# EAGLE design airball_display_board_v1 (EAGLE 9.1.1)
REV: 1

## Sheet 1 of 3
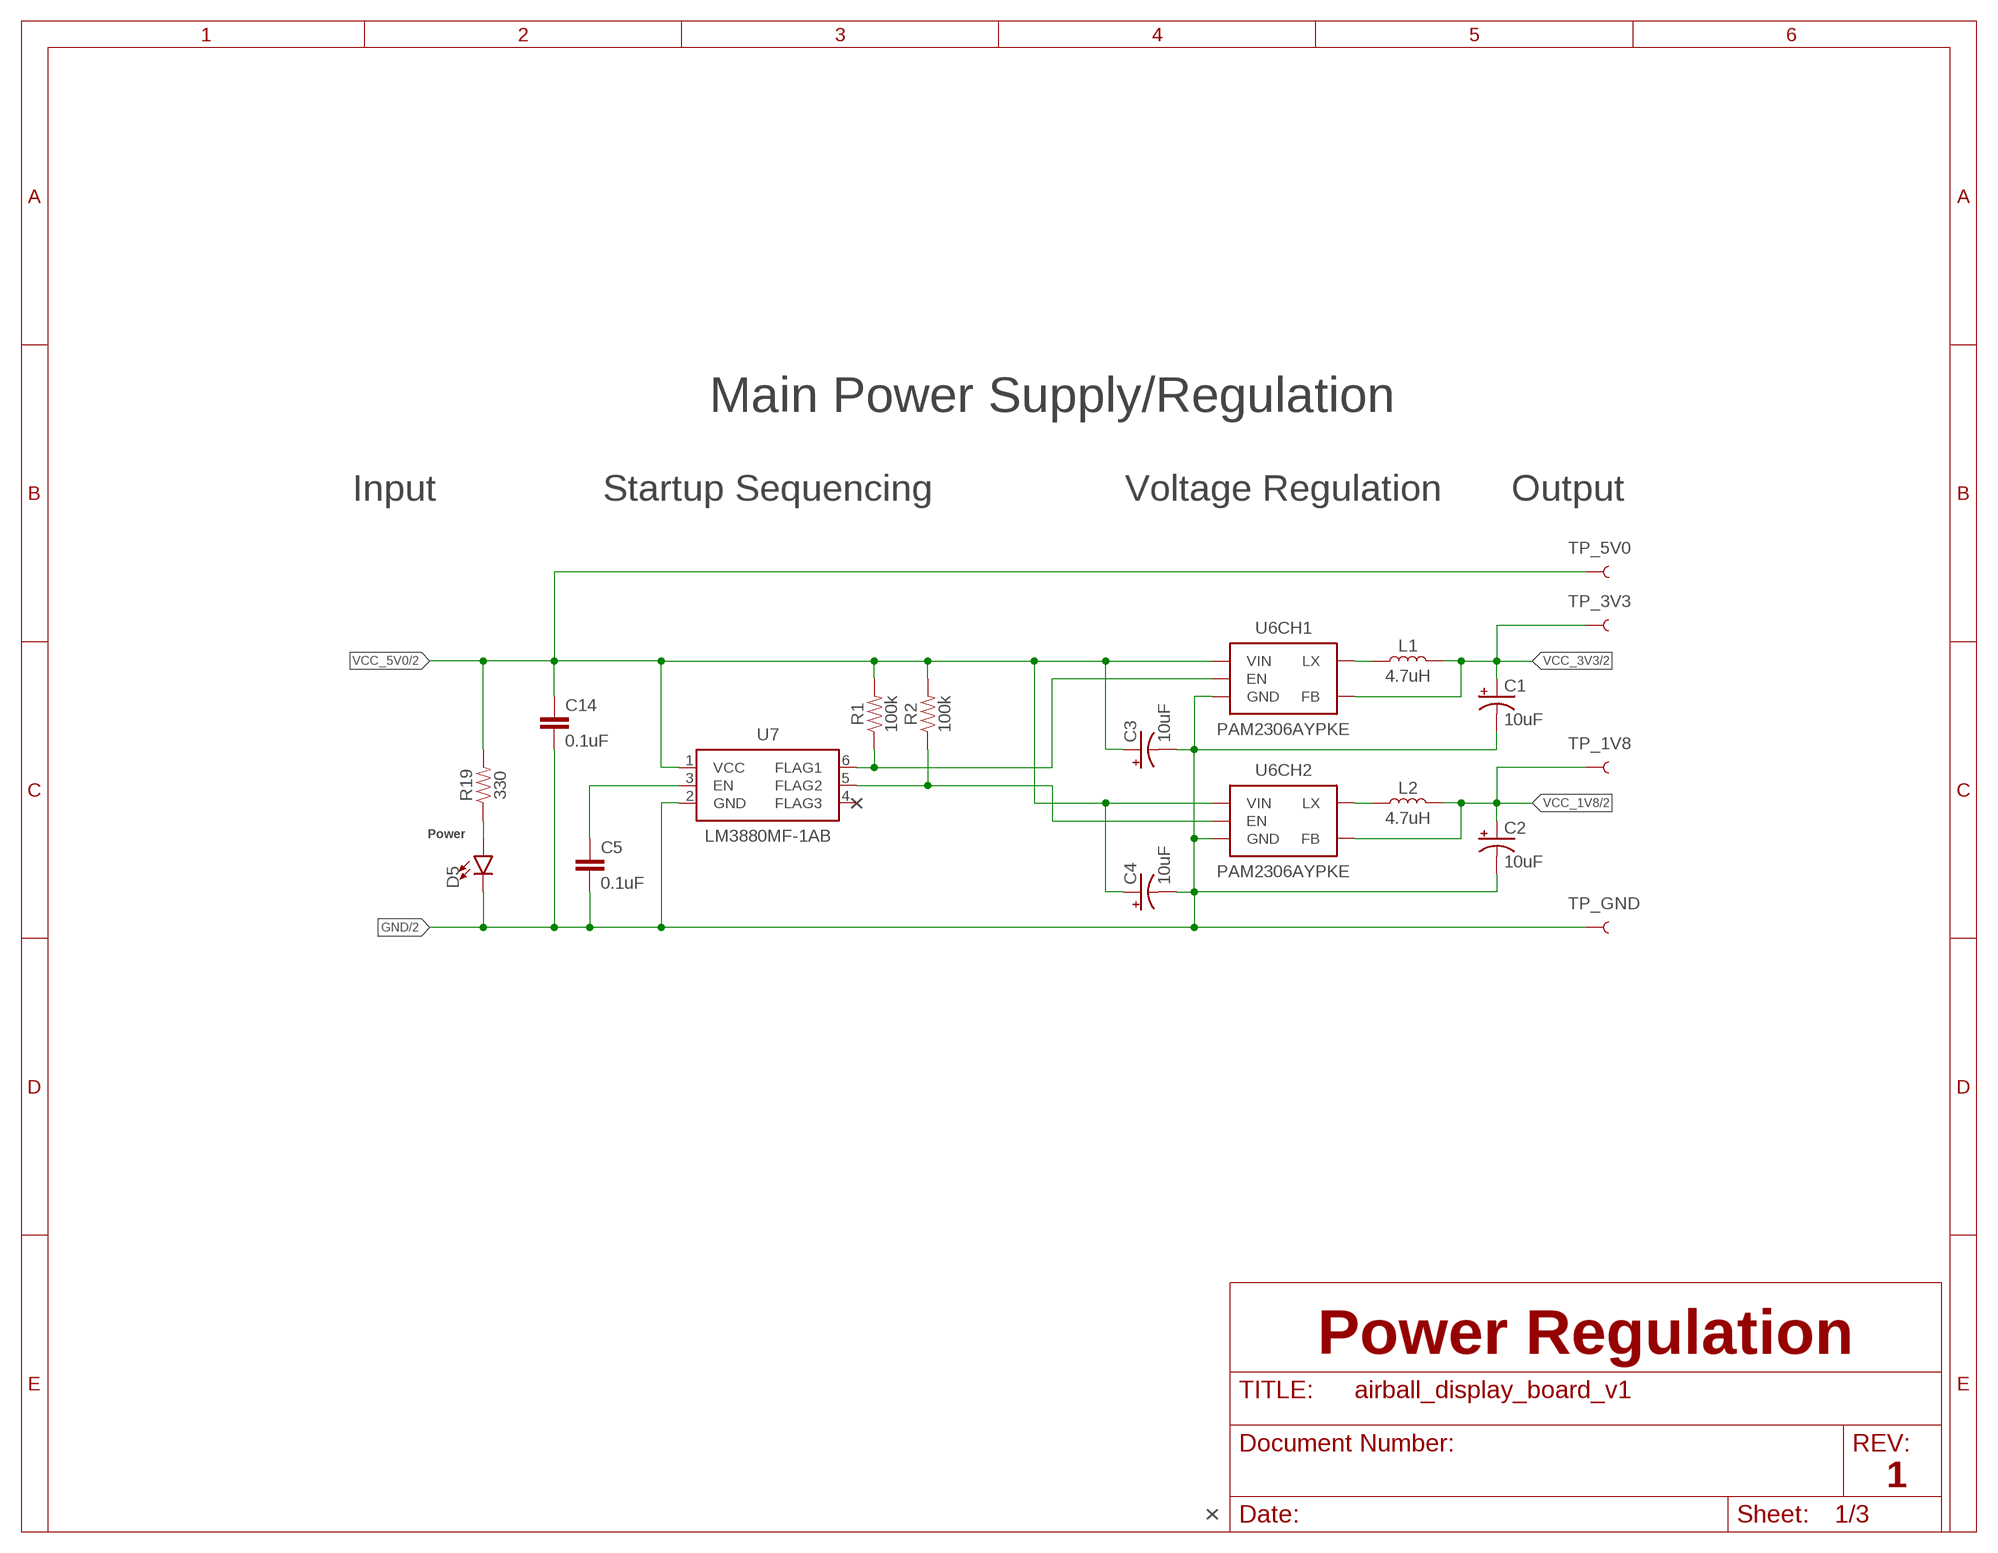
[diagram p0: schematic, sheet 1]

### Parts
C1  10uF  10UF-POLAR-EIA3216-16V-10%(TANT)  [EIA3216]
C2  10uF  10UF-POLAR-EIA3216-16V-10%(TANT)  [EIA3216]
C3  10uF  10UF-POLAR-EIA3216-16V-10%(TANT)  [EIA3216]
C4  10uF  10UF-POLAR-EIA3216-16V-10%(TANT)  [EIA3216]
C5  0.1uF  0.1UF-0603-25V-5%  [0603]
C14  0.1uF  0.1UF-0603-25V-5%  [0603]
D5  LED0603  [LED-0603]
L1  4.7uH  INDUCTOR-SMD_4X4  [INDUCTOR_SMD_4X4MM]
L2  4.7uH  INDUCTOR-SMD_4X4  [INDUCTOR_SMD_4X4MM]
R1  100k  100KOHM-0603-1/10W-1%  [0603]
R2  100k  100KOHM-0603-1/10W-1%  [0603]
R19  330  330OHM-0603-1/10W-1%  [0603]
TP_1V8  TEST-POINT3X5  [PAD.03X.05]
TP_3V3  TEST-POINT3X5  [PAD.03X.05]
TP_5V0  TEST-POINT3X5  [PAD.03X.05]
TP_GND  TEST-POINT3X5  [PAD.03X.05]
U6  PAM2306AYPKE  PAM2306  [WDFN12]
U7  LM3880MF-1AB  LM3880  [SOT23-6]

### Nets
EN_1V8: R2.1 U6.12(CH2:EN) U7.5(FLAG2)
EN_3V3: R1.1 U6.6(CH1:EN) U7.6(FLAG1)
GND [power]: C1.- C2.- C3.- C4.- C5.2 C14.2 D5.C TP_GND.P$1 U6.3(CH2:GND) U6.9(CH1:GND) U6.TH(CH1:GND) U7.2(GND) ; also sheet 2,3
L_VCC_1V8 [power]: L2.1 U6.2(CH2:LX)
L_VCC_3V3 [power]: L1.1 U6.8(CH1:LX)
N$17: C5.1 U7.3(EN)
R_POWER: D5.A R19.1
VCC_1V8 [power]: C2.+ L2.2 TP_1V8.P$1 U6.10(CH2:FB) ; also sheet 2
VCC_3V3 [power]: C1.+ L1.2 TP_3V3.P$1 U6.4(CH1:FB) ; also sheet 2,3
VCC_5V0 [power]: C3.+ C4.+ C14.1 R1.2 R2.2 R19.2 TP_5V0.P$1 U6.1(CH2:VIN) U6.7(CH1:VIN) U7.1(VCC) ; also sheet 2,3
Unconnected: U7.4(FLAG3)

### Notes on the sheet
- Main Power Supply/Regulation
- Input | Startup Sequencing | Voltage Regulation | Output
- ×
- Power
- Power Regulation
- ×

## Sheet 2 of 3
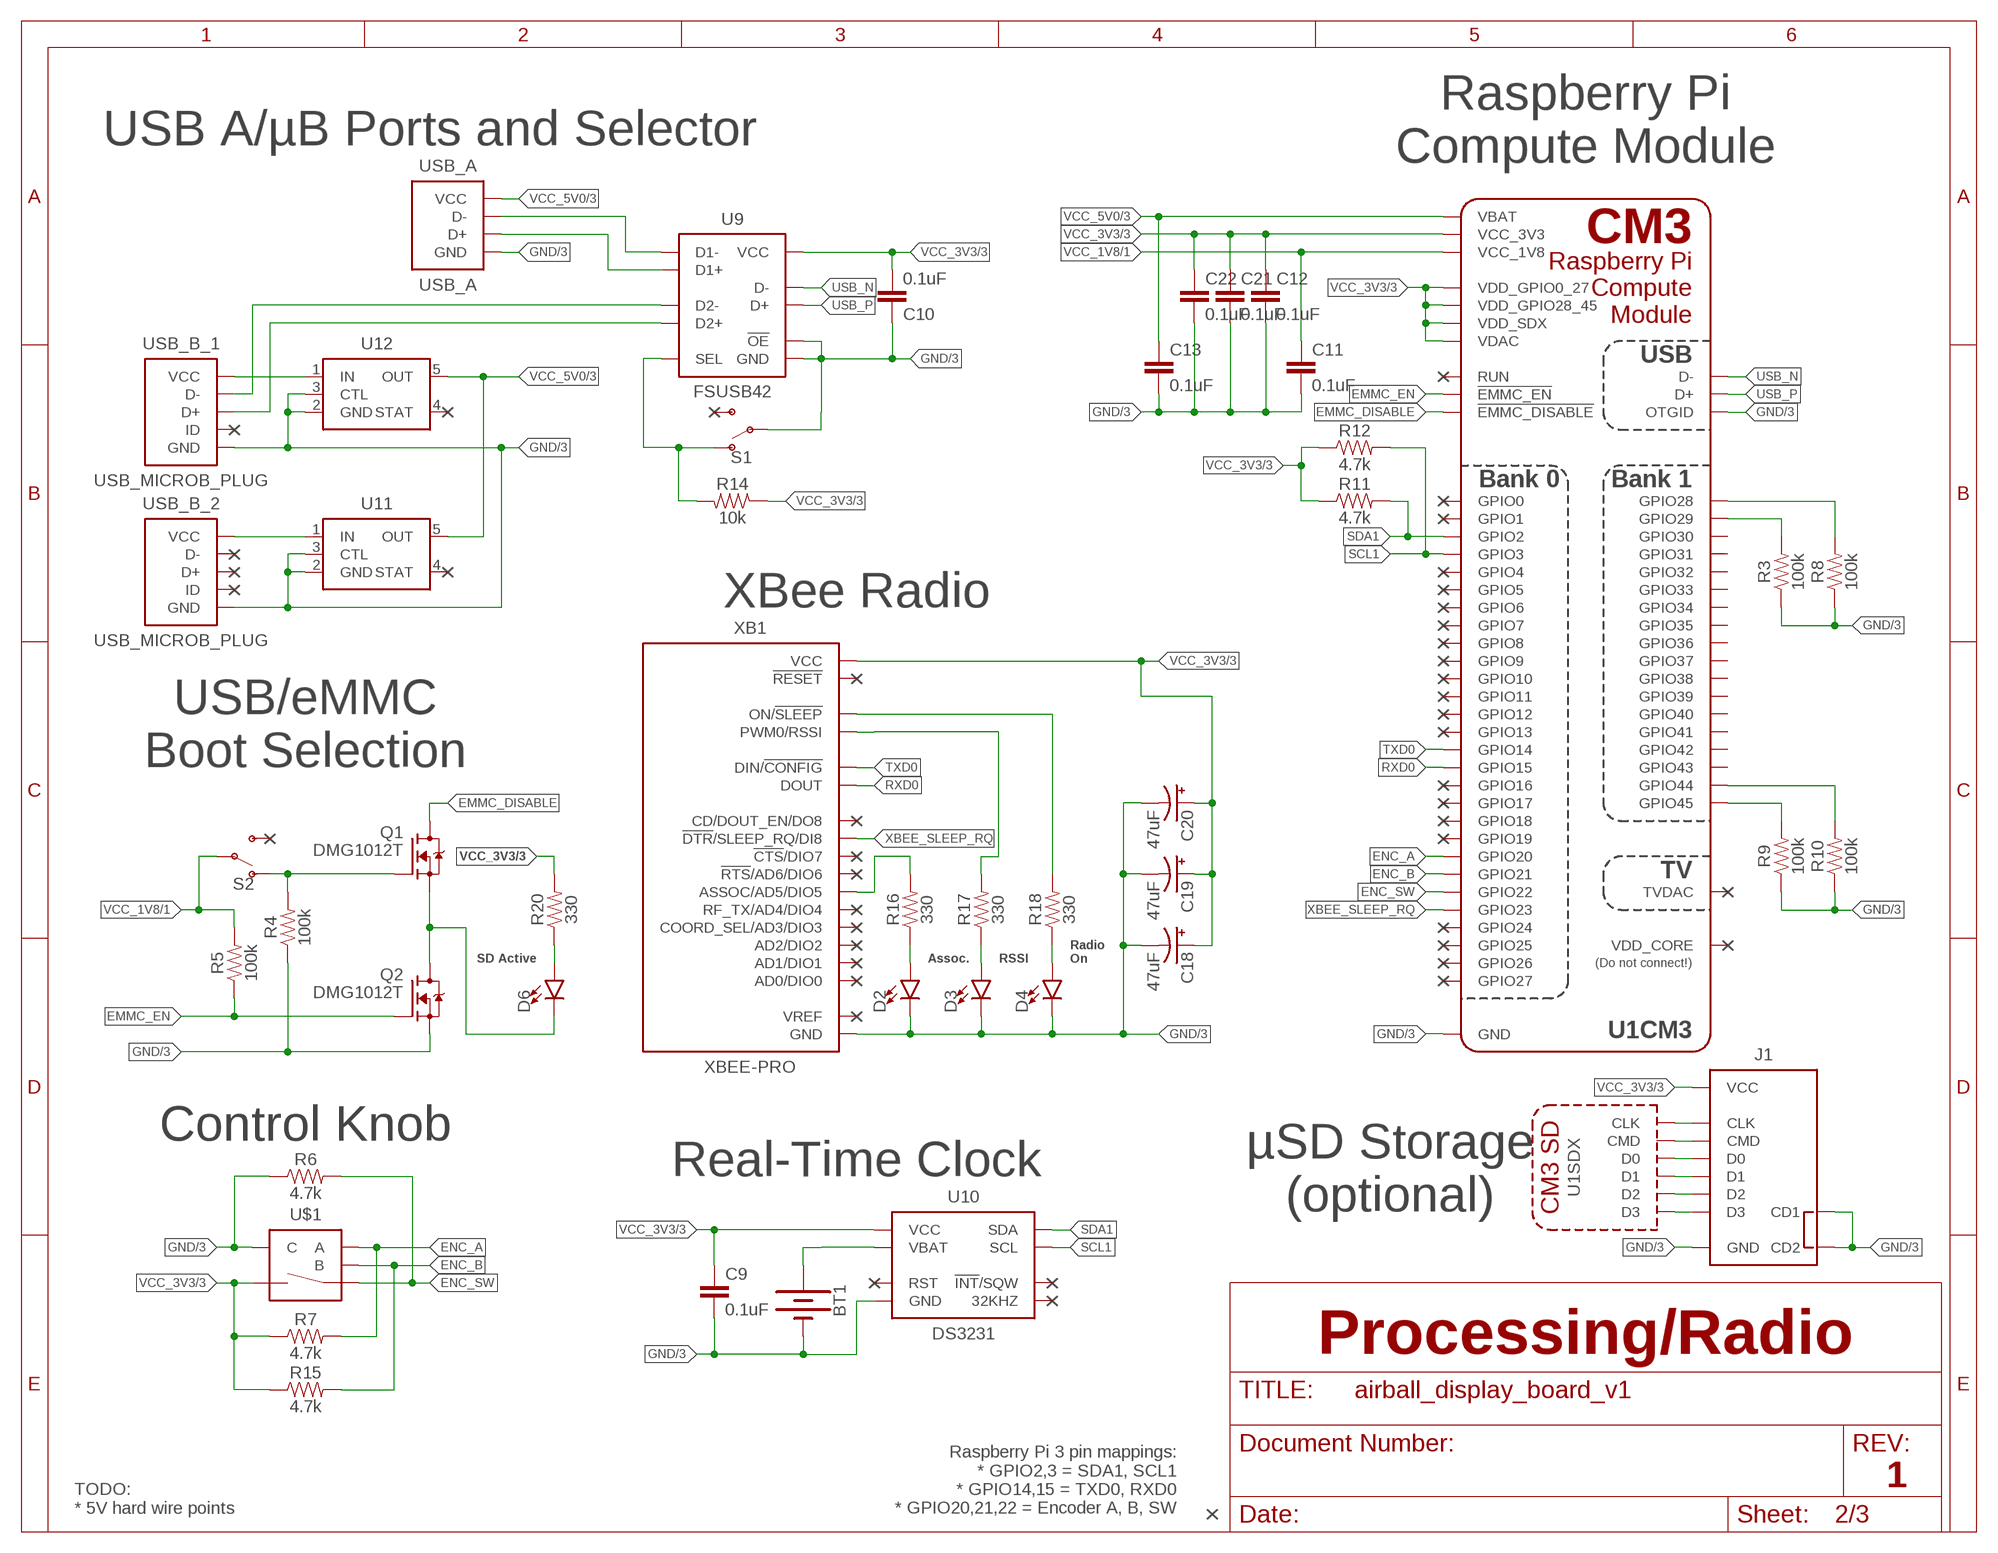
[diagram p1: schematic, sheet 2]

### Parts
BT1  BATTERY-12MM_SMD  [BATTCON_12MM]
C9  0.1uF  0.1UF-0603-25V-5%  [0603]
C10  0.1uF  0.1UF-0603-25V-5%  [0603]
C11  0.1uF  0.1UF-0603-25V-5%  [0603]
C12  0.1uF  0.1UF-0603-25V-5%  [0603]
C13  0.1uF  0.1UF-0603-25V-5%  [0603]
C18  47uF  47UF-POLAR-EIA3528-10V-10%  [EIA3528]
C19  47uF  47UF-POLAR-EIA3528-10V-10%  [EIA3528]
C20  47uF  47UF-POLAR-EIA3528-10V-10%  [EIA3528]
C21  0.1uF  0.1UF-0603-25V-5%  [0603]
C22  0.1uF  0.1UF-0603-25V-5%  [0603]
D2  LED0603  [LED-0603]
D3  LED0603  [LED-0603]
D4  LED0603  [LED-0603]
D6  LED0603  [LED-0603]
J1  MICRO-SD-SD4-MOLEX_104031  [MOLEX_MICRO_SD_104031]
Q1  DMG1012T  [SOT523-3]
Q2  DMG1012T  [SOT523-3]
R3  100k  100KOHM-0603-1/10W-1%  [0603]
R4  100k  100KOHM-0603-1/10W-1%  [0603]
R5  100k  100KOHM-0603-1/10W-1%  [0603]
R6  4.7k  4.7KOHM-0603-1/10W-1%  [0603]
R7  4.7k  4.7KOHM-0603-1/10W-1%  [0603]
R8  100k  100KOHM-0603-1/10W-1%  [0603]
R9  100k  100KOHM-0603-1/10W-1%  [0603]
R10  100k  100KOHM-0603-1/10W-1%  [0603]
R11  4.7k  4.7KOHM-0603-1/10W-1%  [0603]
R12  4.7k  4.7KOHM-0603-1/10W-1%  [0603]
R14  10k  10KOHM-0603-1/10W-1%  [0603]
R15  4.7k  4.7KOHM-0603-1/10W-1%  [0603]
R16  330  330OHM-0603-1/10W-1%  [0603]
R17  330  330OHM-0603-1/10W-1%  [0603]
R18  330  330OHM-0603-1/10W-1%  [0603]
R20  330  330OHM-0603-1/10W-1%  [0603]
S1  SWITCH-SPDT-SMD-RIGHT-ANGLE  [SWITCH_SPST_SMD_A]
S2  SWITCH-SPDT-SMD-RIGHT-ANGLE  [SWITCH_SPST_SMD_A]
U1  RPI_CM3-AMP_1473149  [AMP_1473149]
U9  FSUSB42  [MSOP10]
U10  DS3231  [SOIC16W]
U11  LTC4411  [SOT23-5]
U12  LTC4411  [SOT23-5]
U$1  ENCODER_WITH_SWITCH  [BOURNS_PEC11L]
USB_A  USB_A  [FCI_USB_A_87583]
USB_B_1  USB_MICROB_PLUG  [USB_MICRO_B_TYCO]
USB_B_2  USB_MICROB_PLUG  [USB_MICRO_B_TYCO]
XB1  XBEE-PRO  [XBEE-PRO]

### Nets
EMMC_DISABLE: Q1.2(D) U1.2(CM3:!EMMC_DISABLE)
EMMC_EN: Q2.1(G) R5.1 U1.90(CM3:!EMMC_EN)
ENC_A: R7.2 U1.69(CM3:GPIO20) U$1.A
ENC_B: R15.2 U1.71(CM3:GPIO21) U$1.B
ENC_SW: R6.2 U1.75(CM3:GPIO22) U$1.1(SW+)
GND [power]: BT1.GND(-) C9.2 C10.1 C11.2 C12.2 C13.2 C18.C(-) C19.C(-) C20.C(-) C21.2 C22.2 D2.C D3.C D4.C J1.6(GND) J1.CD1 J1.CD2 J1.SH@1(GND) J1.SH@2(GND) J1.SH@3(GND) J1.SH@4(GND) Q2.3(S) R3.1 R4.1 R6.1 R8.1 R9.1 R10.1 S1.2(P) U1.1(CM3:GND) U1.7(CM3:GND) U1.8(CM3:GND) U1.13(CM3:GND) U1.14(CM3:GND) U1.19(CM3:GND) U1.20(CM3:GND) U1.25(CM3:GND) U1.26(CM3:GND) U1.31(CM3:GND) U1.32(CM3:GND) U1.37(CM3:GND) U1.38(CM3:GND) U1.43(CM3:GND) U1.44(CM3:GND) U1.49(CM3:GND) U1.50(CM3:GND) U1.55(CM3:GND) U1.56(CM3:GND) U1.61(CM3:GND) U1.62(CM3:GND) U1.67(CM3:GND) U1.68(CM3:GND) U1.73(CM3:GND) U1.74(CM3:GND) U1.79(CM3:GND) U1.80(CM3:GND) U1.85(CM3:GND) U1.86(CM3:GND) U1.91(CM3:GND) U1.92(CM3:GND) U1.97(CM3:GND) U1.98(CM3:GND) U1.103(CM3:GND) U1.104(CM3:GND) U1.109(CM3:GND) U1.110(CM3:GND) U1.115(CM3:GND) U1.116(CM3:GND) U1.121(CM3:GND) U1.122(CM3:GND) U1.127(CM3:GND) U1.133(CM3:GND) U1.134(CM3:GND) U1.139(CM3:GND) U1.140(CM3:GND) U1.145(CM3:GND) U1.146(CM3:GND) U1.151(CM3:GND) U1.152(CM3:GND) U1.157(CM3:GND) U1.163(CM3:GND) U1.164(CM3:GND) U1.168(CM3:OTGID) U1.169(CM3:GND) U1.170(CM3:GND) U1.181(CM3:GND) U1.182(CM3:GND) U1.187(CM3:GND) U1.188(CM3:GND) U1.195(CM3:GND) U1.196(CM3:GND) U9.5(GND) U9.10(!OE) U10.5(GND) U10.6(GND) U10.7(GND) U10.8(GND) U10.9(GND) U10.10(GND) U10.11(GND) U10.12(GND) U10.13(GND) U11.2(GND) U11.3(CTL) U12.2(GND) U12.3(CTL) U$1.C USB_A.GND USB_A.SH@1(GND) USB_A.SH@2(GND) USB_B_1.5(GND) USB_B_1.SH@1(GND) USB_B_1.SH@2(GND) USB_B_1.SH@3(GND) USB_B_1.SH@4(GND) USB_B_2.5(GND) USB_B_2.SH@1(GND) USB_B_2.SH@2(GND) USB_B_2.SH@3(GND) USB_B_2.SH@4(GND) XB1.10(GND) ; also sheet 1,3
LED_ACT: D6.C Q1.3(S) Q2.2(D)
N$26 [power]: R14.2 S1.1(O) U9.2(SEL)
PD_GPIO28: R8.2 U1.28(CM3:GPIO28)
PD_GPIO29: R3.2 U1.30(CM3:GPIO29)
PD_GPIO44: R10.2 U1.82(CM3:GPIO44)
PD_GPIO45: R9.2 U1.84(CM3:GPIO45)
R_SD_ACT: D6.A R20.1
R_XBEE_ASSOC: D2.A R16.1
R_XBEE_ON: D4.A R18.1
R_XBEE_RSSI: D3.A R17.1
RTC_VBAT [power]: BT1.PWR@1(+) U10.14(VBAT)
RXD0: U1.53(CM3:GPIO15) XB1.2(DOUT)
SCL1: R12.2 U1.11(CM3:GPIO3) U10.16(SCL)
SD_CLK: J1.5(CLK) U1.10(SDX:CLK)
SD_CMD: J1.3(CMD) U1.12(SDX:CMD)
SD_D0: J1.7(D0) U1.16(SDX:D0)
SD_D1: J1.8(D1) U1.18(SDX:D1)
SD_D2: J1.1(D2) U1.22(SDX:D2)
SD_D3: J1.2(D3) U1.24(SDX:D3)
SDA1: R11.2 U1.9(CM3:GPIO2) U10.15(SDA)
TXD0: U1.51(CM3:GPIO14) XB1.3(DIN/!CONFIG)
USB_A_N: U9.6(D1-) USB_A.D-
USB_A_P: U9.7(D1+) USB_A.D+
USB_A_VCC [power]: U12.1(IN) USB_B_1.1(VCC)
USB_B_N: U9.8(D2-) USB_B_1.2(D-)
USB_B_P: U9.9(D2+) USB_B_1.3(D+)
USB_B_VCC [power]: U11.1(IN) USB_B_2.1(VCC)
USB_BOOT_EN: Q1.1(G) R4.2 S2.1(O)
USB_N: U1.167(CM3:D-) U9.4(D-)
USB_P: U1.165(CM3:D+) U9.3(D+)
VCC_1V8 [power]: C11.1 R5.2 S2.2(P) U1.183(CM3:VCC_1V8) U1.184(CM3:VCC_1V8) U1.185(CM3:VCC_1V8) U1.186(CM3:VCC_1V8) ; also sheet 1
VCC_3V3 [power]: C9.1 C10.2 C12.1 C18.A(+) C19.A(+) C20.A(+) C21.1 C22.1 J1.4(VCC) R7.1 R11.1 R12.1 R14.1 R15.1 R20.2 U1.4(CM3:VDD_SDX) U1.6(CM3:VDD_SDX) U1.39(CM3:VDD_GPIO0_27) U1.40(CM3:VDD_GPIO0_27) U1.41(CM3:VDD_GPIO28_45) U1.42(CM3:VDD_GPIO28_45) U1.189(CM3:VDAC) U1.190(CM3:VDAC) U1.191(CM3:VCC_3V3) U1.192(CM3:VCC_3V3) U1.193(CM3:VCC_3V3) U1.194(CM3:VCC_3V3) U9.1(VCC) U10.2(VCC) U$1.2(SW-) XB1.1(VCC) ; also sheet 1,3
VCC_5V0 [power]: C13.1 U1.197(CM3:VBAT) U1.198(CM3:VBAT) U1.199(CM3:VBAT) U1.200(CM3:VBAT) U11.5(OUT) U12.5(OUT) USB_A.VBUS(VCC) ; also sheet 1,3
XBEE_ASSOC: R16.2 XB1.15(ASSOC/AD5/DIO5)
XBEE_ON: R18.2 XB1.13(ON/!SLEEP)
XBEE_RSSI: R17.2 XB1.6(PWM0/RSSI)
XBEE_SLEEP_RQ: U1.77(CM3:GPIO23) XB1.9(!DTR!/SLEEP_RQ/DI8)
Unconnected: S1.3(S) S2.3(S) U1.3(CM3:GPIO0) U1.5(CM3:GPIO1) U1.15(CM3:GPIO4) U1.17(CM3:GPIO5) U1.21(CM3:GPIO6) U1.23(CM3:GPIO7) U1.27(CM3:GPIO8) U1.29(CM3:GPIO9) U1.33(CM3:GPIO10) U1.34(CM3:GPIO30) U1.35(CM3:GPIO11) U1.36(CM3:GPIO31) U1.45(CM3:GPIO12) U1.46(CM3:GPIO32) U1.47(CM3:GPIO13) U1.48(CM3:GPIO33) U1.52(CM3:GPIO34) U1.54(CM3:GPIO35) U1.57(CM3:GPIO16) U1.58(CM3:GPIO36) U1.59(CM3:GPIO17) U1.60(CM3:GPIO37) U1.63(CM3:GPIO18) U1.64(CM3:GPIO38) U1.65(CM3:GPIO19) U1.66(CM3:GPIO39) U1.70(CM3:GPIO40) U1.72(CM3:GPIO41) U1.76(CM3:GPIO42) U1.78(CM3:GPIO43) U1.81(CM3:GPIO24) U1.83(CM3:GPIO25) U1.87(CM3:GPIO26) U1.89(CM3:GPIO27) U1.93(DSI0:D1_N) U1.94(DSI1:D0_P) U1.95(DSI0:D1_P) U1.96(DSI1:D0_N) U1.99(DSI0:D0_N) U1.100(DSI1:C_P) U1.101(DSI0:D0_P) U1.102(DSI1:C_N) U1.105(DSI0:C_N) U1.106(DSI1:D3_P) U1.107(DSI0:C_P) U1.108(DSI1:D3_N) U1.112(DSI1:D2_P) U1.114(DSI1:D2_N) U1.118(DSI1:D1_P) U1.120(DSI1:D1_N) U1.135(CAM1:D3_P) U1.136(CAM0:D0_P) U1.137(CAM1:D3_N) U1.138(CAM0:D0_N) U1.141(CAM1:D2_P) U1.142(CAM0:C_P) U1.143(CAM1:D2_N) U1.144(CAM0:C_N) U1.147(CAM1:C_P) U1.148(CAM0:D1_P) U1.149(CAM1:C_N) U1.150(CAM0:D1_N) U1.153(CAM1:D1_P) U1.155(CAM1:D1_N) U1.159(CAM1:D0_P) U1.161(CAM1:D0_N) U1.166(CM3:TVDAC) U1.172(VCJTAG:!TRST) U1.174(VCJTAG:TDI) U1.176(VCJTAG:TMS) U1.177(CM3:RUN) U1.178(VCJTAG:TDO) U1.179(CM3:VDD_CORE) U1.180(VCJTAG:TCK) U10.1(32KHZ) U10.3(!INT!/SQW) U10.4(RST) U11.4(STAT) U12.4(STAT) USB_B_1.4(ID) USB_B_2.2(D-) USB_B_2.3(D+) USB_B_2.4(ID) XB1.4(CD/DOUT_EN/DO8) XB1.5(!RESET) XB1.11(RF_TX/AD4/DIO4) XB1.12(!CTS!/DIO7) XB1.14(VREF) XB1.16(!RTS!/AD6/DIO6) XB1.17(COORD_SEL/AD3/DIO3) XB1.18(AD2/DIO2) XB1.19(AD1/DIO1) XB1.20(AD0/DIO0)

### Notes on the sheet
- USB A/µB Ports and Selector
- Raspberry Pi
  Compute Module
- ×
- × | ×
- ×
- ×
- ×
- ×
- × | × | ×
- × | ×
- XBee Radio | ×
- ×
- ×
- ×
- × | ×
- ×
- ×
- ×
- USB/eMMC
  Boot Selection
- ×
- ×
- × | ×
- × | ×
- ×
- ×
- ×
- ×
- × | ×
- × | × | ×
- SD Active | × | Assoc. | RSSI
- Radio
  On
- ×
- × | ×
- ×
- Control Knob
- Real-Time Clock
- µSD Storage
  (optional)
- × | ×
- ×
- Processing/Radio
- TODO:
  * 5V hard wire points
- Raspberry Pi 3 pin mappings:
  * GPIO2,3 = SDA1, SCL1
  * GPIO14,15 = TXD0, RXD0
  * GPIO20,21,22 = Encoder A, B, SW
- ×

## Sheet 3 of 3
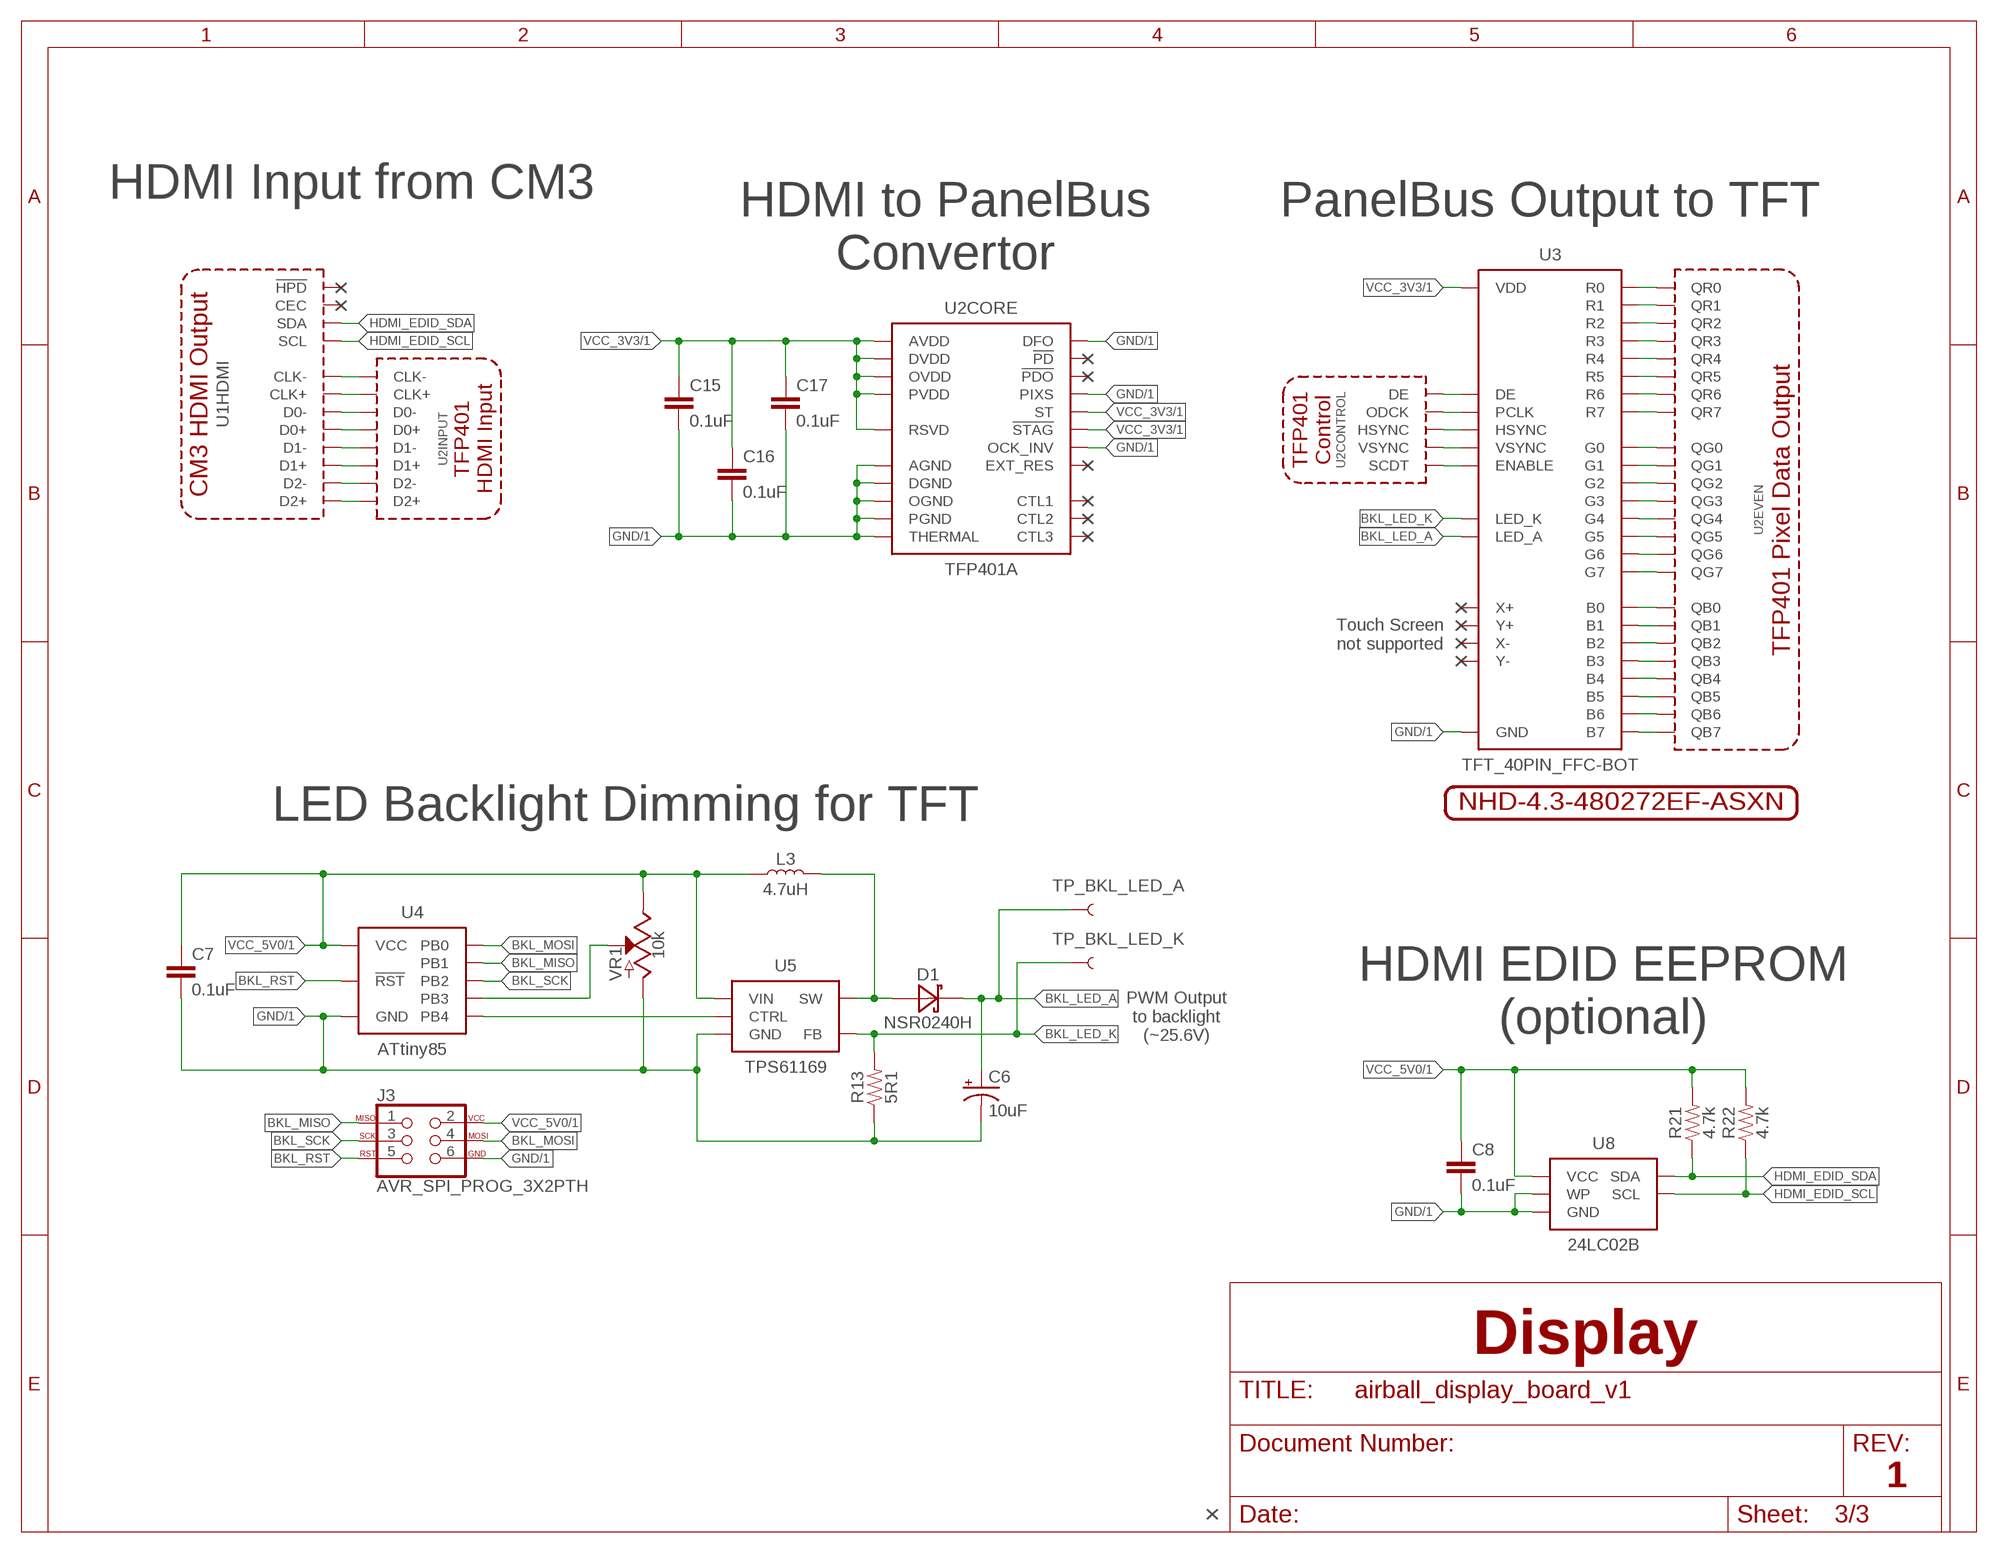
[diagram p2: schematic, sheet 3]

### Parts
C6  10uF  10UF-POLAR-EIA3216-16V-10%(TANT)  [EIA3216]
C7  0.1uF  0.1UF-0603-25V-5%  [0603]
C8  0.1uF  0.1UF-0603-25V-5%  [0603]
C15  0.1uF  0.1UF-0603-25V-5%  [0603]
C16  0.1uF  0.1UF-0603-25V-5%  [0603]
C17  0.1uF  0.1UF-0603-25V-5%  [0603]
D1  NSR0240H  DIODE-SCHOTTKY-SOD323  [SOD323]
J3  AVR_SPI_PROG_3X2PTH  [2X3]
L3  4.7uH  INDUCTOR-SMD_4X4  [INDUCTOR_SMD_4X4MM]
R13  5R1  RESISTOR0603  [0603]
R21  4.7k  4.7KOHM-0603-1/10W-1%  [0603]
R22  4.7k  4.7KOHM-0603-1/10W-1%  [0603]
TP_BKL_LED_A  TEST-POINT3X5  [PAD.03X.05]
TP_BKL_LED_K  TEST-POINT3X5  [PAD.03X.05]
U2  TFP401A  TFP401-POWER_LITE  [TQFP100_POWER_LITE]
U3  TFT_40PIN_FFC-BOT  [HIROSE_FFC40_FH12-40S-0.5SH]
U4  ATtiny85  ATTINY25/45/85  [SOIC8-5.4]
U5  TPS61169  [SOT353-5]
U8  24LC02B  [SOT23-5]
U$4  NHD-4.3-480272EF-ASXN  [NHD-4.3-480272EF-ASXN]
VR1  10k  POTENTIOMETERPTV09A  [BOURNS_PTV09A]

### Nets
B0: U2.10(EVEN:QB0) U3.21(B0)
B1: U2.11(EVEN:QB1) U3.22(B1)
B2: U2.12(EVEN:QB2) U3.23(B2)
B3: U2.13(EVEN:QB3) U3.24(B3)
B4: U2.14(EVEN:QB4) U3.25(B4)
B5: U2.15(EVEN:QB5) U3.26(B5)
B6: U2.16(EVEN:QB6) U3.27(B6)
B7: U2.17(EVEN:QB7) U3.28(B7)
BKL_ADJ: U4.2(PB3) VR1.2(S)
BKL_LED_A [power]: C6.+ D1.K(C) TP_BKL_LED_A.P$1 U3.2(LED_A)
BKL_LED_K [power]: R13.2 TP_BKL_LED_K.P$1 U3.1(LED_K) U5.3(FB)
BKL_MISO: J3.1 U4.6(PB1)
BKL_MOSI: J3.4 U4.5(PB0)
BKL_PWM: U4.3(PB4) U5.4(CTRL)
BKL_RST: J3.5 U4.1(!RST)
BKL_SCK: J3.3 U4.7(PB2)
DE: U2.46(CONTROL:DE) U3.34(DE)
G0: U2.20(EVEN:QG0) U3.13(G0)
G1: U2.21(EVEN:QG1) U3.14(G1)
G2: U2.22(EVEN:QG2) U3.15(G2)
G3: U2.23(EVEN:QG3) U3.16(G3)
G4: U2.24(EVEN:QG4) U3.17(G4)
G5: U2.25(EVEN:QG5) U3.18(G5)
G6: U2.26(EVEN:QG6) U3.19(G6)
G7: U2.27(EVEN:QG7) U3.20(G7)
GND [power]: C6.- C7.2 C8.2 C15.2 C16.2 C17.2 J3.6 R13.1 U2.1(CORE:DFO) U2.4(CORE:PIXS) U2.5(CORE:DGND) U2.19(CORE:OGND) U2.28(CORE:OGND) U2.39(CORE:DGND) U2.45(CORE:OGND) U2.58(CORE:OGND) U2.68(CORE:DGND) U2.76(CORE:OGND) U2.79(CORE:AGND) U2.83(CORE:AGND) U2.87(CORE:AGND) U2.89(CORE:AGND) U2.92(CORE:AGND) U2.98(CORE:PGND) U2.100(CORE:OCK_INV) U2.TH21(CORE:THERMAL) U2.TH22(CORE:THERMAL) U2.TH23(CORE:THERMAL) U2.TH24(CORE:THERMAL) U2.TH25(CORE:THERMAL) U2.TH30(CORE:THERMAL) U2.TH34(CORE:THERMAL) U2.TH39(CORE:THERMAL) U2.TH43(CORE:THERMAL) U2.TH48(CORE:THERMAL) U2.TH52(CORE:THERMAL) U2.TH57(CORE:THERMAL) U2.TH58(CORE:THERMAL) U2.TH59(CORE:THERMAL) U2.TH60(CORE:THERMAL) U2.TH61(CORE:THERMAL) U2.THA(CORE:THERMAL) U2.THB(CORE:THERMAL) U3.3(GND) U3.29(GND) U3.36(GND) U4.4(GND) U5.2(GND) U8.2(GND) U8.5(WP) VR1.1(A) ; also sheet 1,2
HDMI_CLK_N: U1.111(HDMI:CLK-) U2.94(INPUT:CLK-)
HDMI_CLK_P: U1.113(HDMI:CLK+) U2.93(INPUT:CLK+)
HDMI_D0_N: U1.117(HDMI:D0-) U2.91(INPUT:D0-)
HDMI_D0_P: U1.119(HDMI:D0+) U2.90(INPUT:D0+)
HDMI_D1_N: U1.123(HDMI:D1-) U2.86(INPUT:D1-)
HDMI_D1_P: U1.125(HDMI:D1+) U2.85(INPUT:D1+)
HDMI_D2_N: U1.129(HDMI:D2-) U2.81(INPUT:D2-)
HDMI_D2_P: U1.131(HDMI:D2+) U2.80(INPUT:D2+)
HDMI_EDID_SCL: R22.1 U1.175(HDMI:SCL) U8.1(SCL)
HDMI_EDID_SDA: R21.1 U1.173(HDMI:SDA) U8.3(SDA)
HSYNC: U2.48(CONTROL:HSYNC) U3.32(HSYNC)
L_BKL [power]: D1.A L3.2 U5.1(SW)
PCLK: U2.44(CONTROL:ODCK) U3.30(PCLK)
R0: U2.30(EVEN:QR0) U3.5(R0)
R1: U2.31(EVEN:QR1) U3.6(R1)
R2: U2.32(EVEN:QR2) U3.7(R2)
R3: U2.33(EVEN:QR3) U3.8(R3)
R4: U2.34(EVEN:QR4) U3.9(R4)
R5: U2.35(EVEN:QR5) U3.10(R5)
R6: U2.36(EVEN:QR6) U3.11(R6)
R7: U2.37(EVEN:QR7) U3.12(R7)
SCDT: U2.8(CONTROL:SCDT) U3.31(ENABLE)
VCC_3V3 [power]: C15.1 C16.1 C17.1 U2.3(CORE:ST) U2.6(CORE:DVDD) U2.7(CORE:!STAG) U2.18(CORE:OVDD) U2.29(CORE:OVDD) U2.38(CORE:DVDD) U2.43(CORE:OVDD) U2.57(CORE:OVDD) U2.67(CORE:DVDD) U2.78(CORE:OVDD) U2.82(CORE:AVDD) U2.84(CORE:AVDD) U2.88(CORE:AVDD) U2.95(CORE:AVDD) U2.97(CORE:PVDD) U2.99(CORE:RSVD) U3.4(VDD) ; also sheet 1,2
VCC_5V0 [power]: C7.1 C8.1 J3.2 L3.1 R21.2 R22.2 U4.8(VCC) U5.5(VIN) U8.4(VCC) VR1.3(E) ; also sheet 1,2
VSYNC: U2.47(CONTROL:VSYNC) U3.33(VSYNC)
Unconnected: U1.88(HDMI:!HPD) U1.171(HDMI:CEC) U2.2(CORE:!PD) U2.9(CORE:!PDO) U2.40(CORE:CTL1) U2.41(CORE:CTL2) U2.42(CORE:CTL3) U2.49(ODD:QB0) U2.50(ODD:QB1) U2.51(ODD:QB2) U2.52(ODD:QB3) U2.53(ODD:QB4) U2.54(ODD:QB5) U2.55(ODD:QB6) U2.56(ODD:QB7) U2.59(ODD:QG0) U2.60(ODD:QG1) U2.61(ODD:QG2) U2.62(ODD:QG3) U2.63(ODD:QG4) U2.64(ODD:QG5) U2.65(ODD:QG6) U2.66(ODD:QG7) U2.69(ODD:QR0) U2.70(ODD:QR1) U2.71(ODD:QR2) U2.72(ODD:QR3) U2.73(ODD:QR4) U2.74(ODD:QR5) U2.75(ODD:QR6) U2.77(ODD:QR7) U2.96(CORE:EXT_RES) U3.37(X+) U3.38(Y+) U3.39(X-) U3.40(Y-)

### Notes on the sheet
- HDMI Input from CM3
- PanelBus Output to TFT
- HDMI to PanelBus
  Convertor
- ×
- ×
- ×
- ×
- ×
- ×
- ×
- ×
- ×
- ×
- Touch Screen
  not supported
- ×
- ×
- LED Backlight Dimming for TFT
- PWM Output
  to backlight
  (~25.6V)
- HDMI EDID EEPROM
  (optional)
- Display
- ×

## Library data of the parts
BT1 = SparkFun-Batteries:BATTERY: Battery - Single Cell A variety of battery chemistries, sizes, and footprints. Device List: 20MM_PTH - Coin Cell Battery Holder - 20mm (PTH) <https://www.sparkfun.com/products/783> 6.8MM_PTH - Coin Cell Battery Holder - 6.8MM(SMD) <https://www.digikey.com/product-detail/en/seiko-instruments/MS621FE-FL11E/728-1057-ND/1889208?WT.srch=1&gclid=CNOQ5a6LzdQCFZS2wAodXCkE0g> 12MM_SMD - Coin Cell Battery Holder - 12mm (SMD) <https://www.sparkfun.com/products/10592> 12MM_PTH - Coin Cell Battery Holder - 12mm (PTH) <https://www.sparkfun.com/products/7948> 20MM_SMD - 20mm Coin Cell Battery Holder (SMD) (2 legs) Used on the Big Time Watch Kit <https://www.sparkfun.com/products/11734> 20MM_SMD_4LEGS - Coin Cell Battery Holder - 20mm (SMD) <https://www.sparkfun.com/products/11892> 20MM_SMD_4LEGS_OVERPASTE - Coin Cell Battery Holder - 20mm (SMD) <https://www.sparkfun.com/products/11892> (Over-paste on the legs) 24.5MM_PTH - Coin Cell Battery Holder - 24.5mm (PTH) <https://www.sparkfun.com/products/8863> 9V - 9V Battery Holder - PC Mount Used on the SparkFun SparkPunk Sound Kit <https://www.sparkfun.com/products/11177> and SparkFun SparkPunk Sequencer Kit <https://www.sparkfun.com/products/12707> 18650 - Battery Holder - 18650 (PTH) <https://www.sparkfun.com/products/13113> AA - Battery Holder - 1xAA (PTH) <https://www.sparkfun.com/products/7949> AAA - Battery Holder - 1xAAA (PTH) <https://www.sparkfun.com/products/12718> AA_KIT - Battery Holder - 1xAA (PTH) <https://www.sparkfun.com/products/7949> Special kit package - pads only have exposed copper on one side of the board. AAA_KIT - Battery Holder - 1xAAA (PTH) <https://www.sparkfun.com/products/12718> Special kit package - pads only have exposed copper on one side of the board.; PROD_ID: BATT-08044; SF_SKU: PRT-10592
C1-C4 C6 = SparkFun-Capacitors:10UF-POLAR: 10.0µF polarized capacitors A capacitor is a passive two-terminal electrical component used to store electrical energy temporarily in an electric field.; PROD_ID: CAP-00811
C5 C7-C17 C21 C22 = SparkFun-Capacitors:0.1UF: 0.1µF ceramic capacitors A capacitor is a passive two-terminal electrical component used to store electrical energy temporarily in an electric field.; PROD_ID: CAP-08604
C18-C20 = SparkFun-Capacitors:47UF-POLAR: 47µF polarized capacitors A capacitor is a passive two-terminal electrical component used to store electrical energy temporarily in an electric field.; PROD_ID: CAP-08310
D1 = airball:DIODE-SCHOTTKY
D2-D6 = SparkFun-LED:LED: LED (Generic) Standard schematic elements and footprints for 5mm, 3mm, 1206, and 0603 sized LEDs. Generic LEDs with no color specified.
J1 = airball:MICRO-SD-SD4
J3 = SparkFun-Connectors:AVR_SPI_PROG_3X2: AVR ISP 6 Pin This is the reduced ISP connector for AVR programming. Common on Arduino. This footprint will take up less PCB space and can be used with a 10-pin to 6-pin adapter such as SKU: BOB-08508 **Special note about "TEST_POINT" package. The stop mask is on the top side, so if you want your programming test points to be on the bottom of your board, make sure to place this package on the bottom side of the board. This also ensure that the orientation to program from the bottom side will be correct. SparkFun Products: SparkFun ISP Pogo Adapter <https://www.sparkfun.com/products/11591> - NS Tiny AVR Programmer <https://www.sparkfun.com/products/11801> -PTH
L1-L3 = airball:INDUCTOR
Q1 Q2 = airball:DMG1012T
R1-R5 R8-R10 = SparkFun-Resistors:100KOHM: 100kΩ resistor A resistor is a passive two-terminal electrical component that implements electrical resistance as a circuit element. Resistors act to reduce current flow, and, at the same time, act to lower voltage levels within circuits. - Wikipedia; PROD_ID: RES-07828
R6 R7 R11 R12 R15 R21 R22 = SparkFun-Resistors:4.7KOHM: 4.7kΩ resistor A resistor is a passive two-terminal electrical component that implements electrical resistance as a circuit element. Resistors act to reduce current flow, and, at the same time, act to lower voltage levels within circuits. - Wikipedia; PROD_ID: RES-07857
R13 = SparkFun-Resistors:RESISTOR: Generic Resistor Package
R14 = SparkFun-Resistors:10KOHM: 10kΩ resistor A resistor is a passive two-terminal electrical component that implements electrical resistance as a circuit element. Resistors act to reduce current flow, and, at the same time, act to lower voltage levels within circuits. - Wikipedia; PROD_ID: RES-00824
R16-R20 = SparkFun-Resistors:330OHM: 330Ω resistor A resistor is a passive two-terminal electrical component that implements electrical resistance as a circuit element. Resistors act to reduce current flow, and, at the same time, act to lower voltage levels within circuits. - Wikipedia; PROD_ID: RES-00818
S1 S2 = SparkFun-Switches:SWITCH-SPDT: Single Pole, Double Throw (SPDT) Switch Single-pole, double-throw (SPDT) switch. Variant Overview SMD-AYZ0202 Surface Mount DPDT Switch <https://www.sparkfun.com/products/597> (COM-00597) Used on e.g. LilyPad Arduino USB - ATmega32U4 Board <https://www.sparkfun.com/products/12049> PTH-11.6X4.0MM SPDT Mini Power Switch <https://www.sparkfun.com/products/102> (COM-00102) Used on e.g. SparkFun Simon Says - Through-Hole Soldering Kit <https://www.sparkfun.com/products/10547> (KIT-10547) PTH-11.6X4.0MM-KIT KIT version of SPDT Mini Power Switch - Simplifies soldering by removing tStop of switch pins - only one side can be soldered. PTH-11.6X4.0MM-LOCK LOCK version of SPDT Mini Power Switch - Offset pins hold switch in place for easier soldering. SMD-RIGHT-ANGLE Surface Mount Right Angle Switch <https://www.sparkfun.com/products/10860> (COM-10860) Used on e.g. SparkFun ESP8266 Thing <https://www.sparkfun.com/products/13231>; PROD_ID: SWCH-10651; SF_SKU: COM-10860
TP_1V8 TP_3V3 TP_5V0 TP_BKL_LED_A TP_BKL_LED_K TP_GND = SparkFun-Connectors:TEST-POINT: SparkFun Test Points Bare copper test points for troubleshooting or In-Circuit-Testing. These are used by our Production team for verifying production board runs using pogo-pins on test beds. SparkFun Products: SparkFun LSM9DS1 Breakout <https://www.sparkfun.com/products/13284> SparkFun PSOC <https://www.sparkfun.com/products/13714> SparkFun Load Cell Amplifier <https://www.sparkfun.com/products/13879>
U1 = airball:RPI_CM3
U2 = airball:TFP401
U3 = airball:TFT_40PIN_FFC
U4 = airball:ATTINY25/45/85
U5 = airball:TPS61169
U6 = airball:PAM2306
U7 = airball:LM3880
U8 = airball:24LC02B
U9 = airball:FSUSB42
U10 = airball:DS3231
U11 U12 = airball:LTC4411
U$1 = airball:ENCODER_WITH_SWITCH
U$4 = airball:NHD-4.3-480272EF-ASXN
USB_A = airball:USB_A
USB_B_1 USB_B_2 = airball:USB_MICROB_PLUG: USB Micro-B Plug Comes in a variety of packages. Check out Hirose's ZX-x0 line: http://www.hirose.co.jp/cataloge_hp/e24200011.pdf
VR1 = airball:POTENTIOMETER
XB1 = airball:XBEE: XBee (TM) /XBee-PRO(TM) OEM RF Modules Source: MaxStream, Inc. xbee_productmanual.pdf; MPN: XBP24-AWI-001; OC_FARNELL: 1337916; OC_NEWARK: 42M2667

## Net classes
0 default: clearance 0.205 mm
1 power: width 0.305 mm

## Board
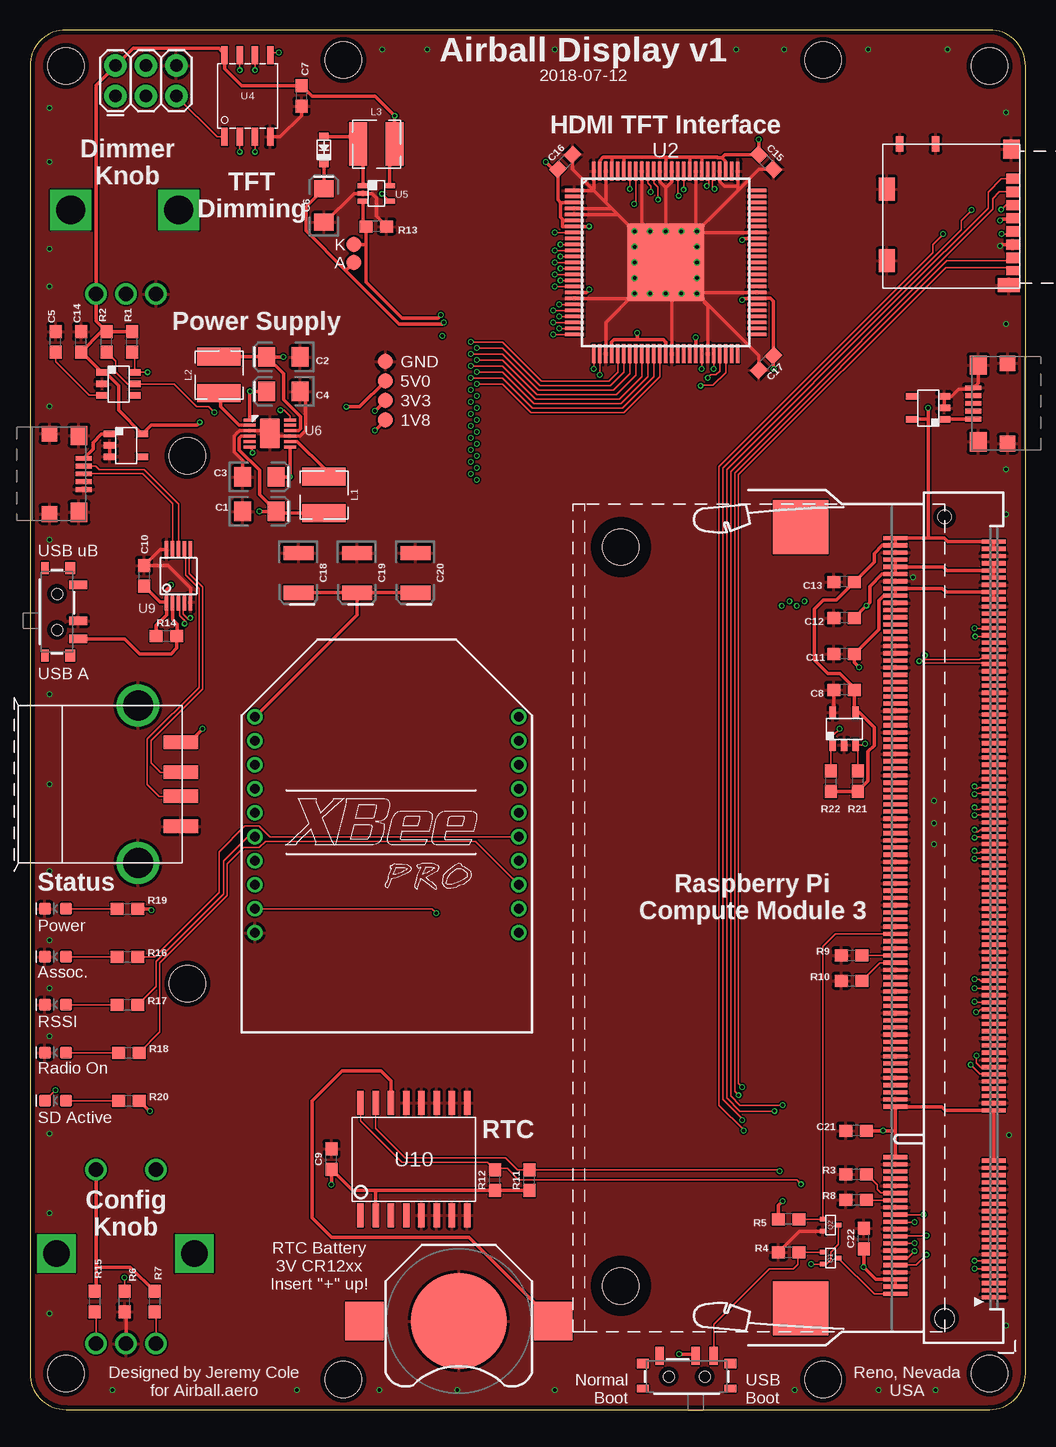
[diagram p3: board, top side]
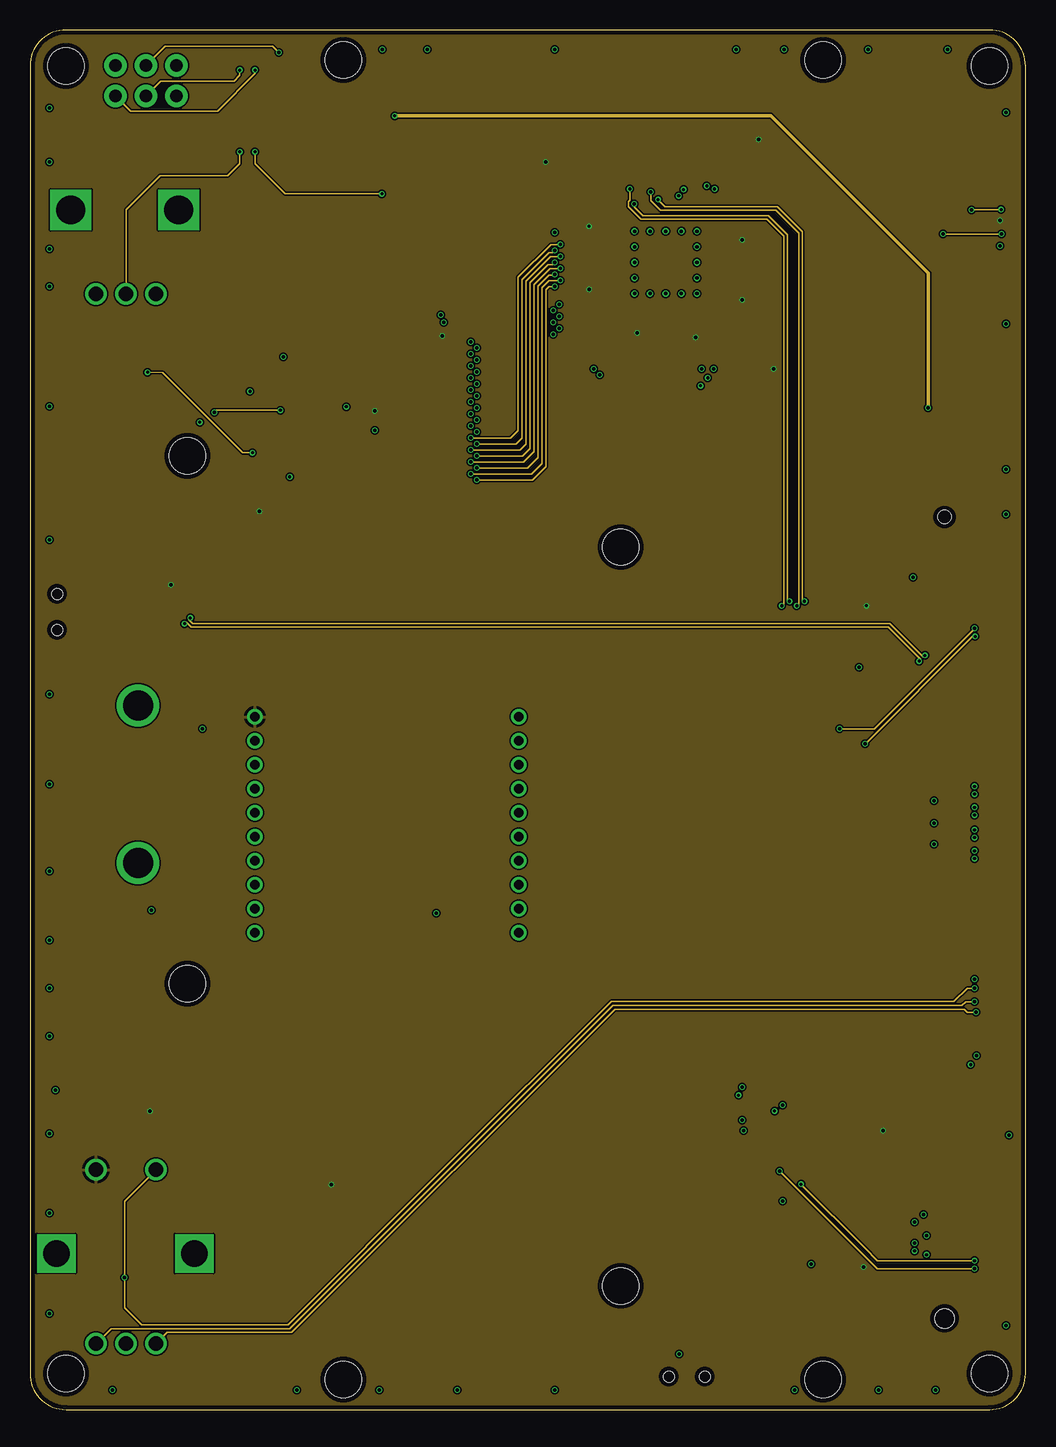
[diagram p4: board, inner layer Route2]
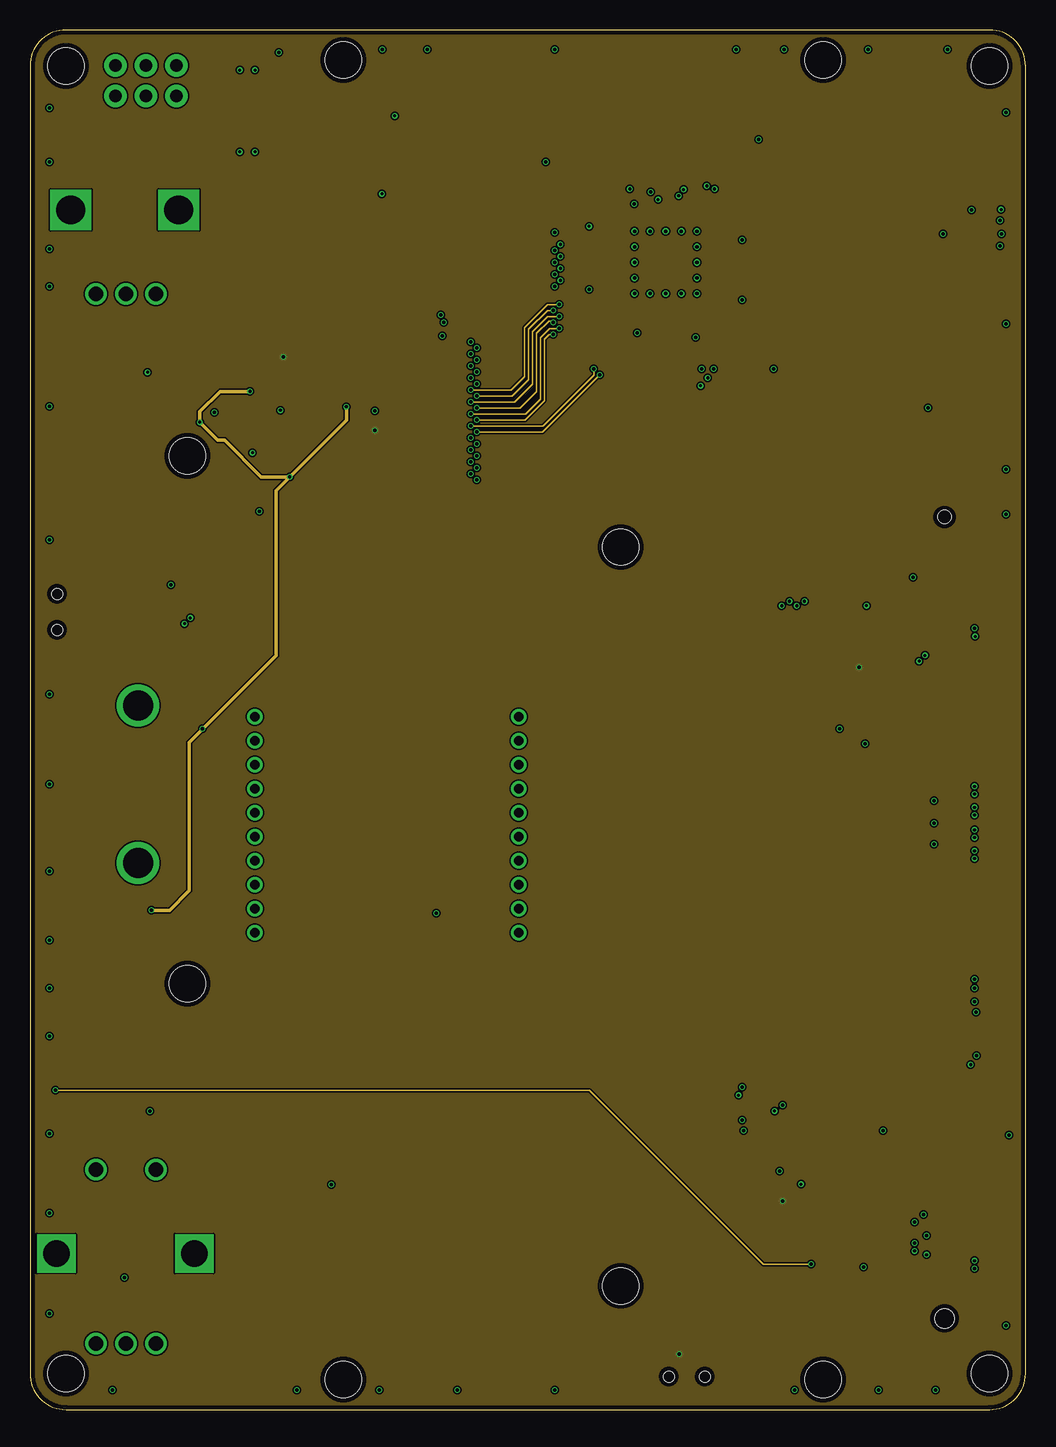
[diagram p5: board, inner layer Route15]
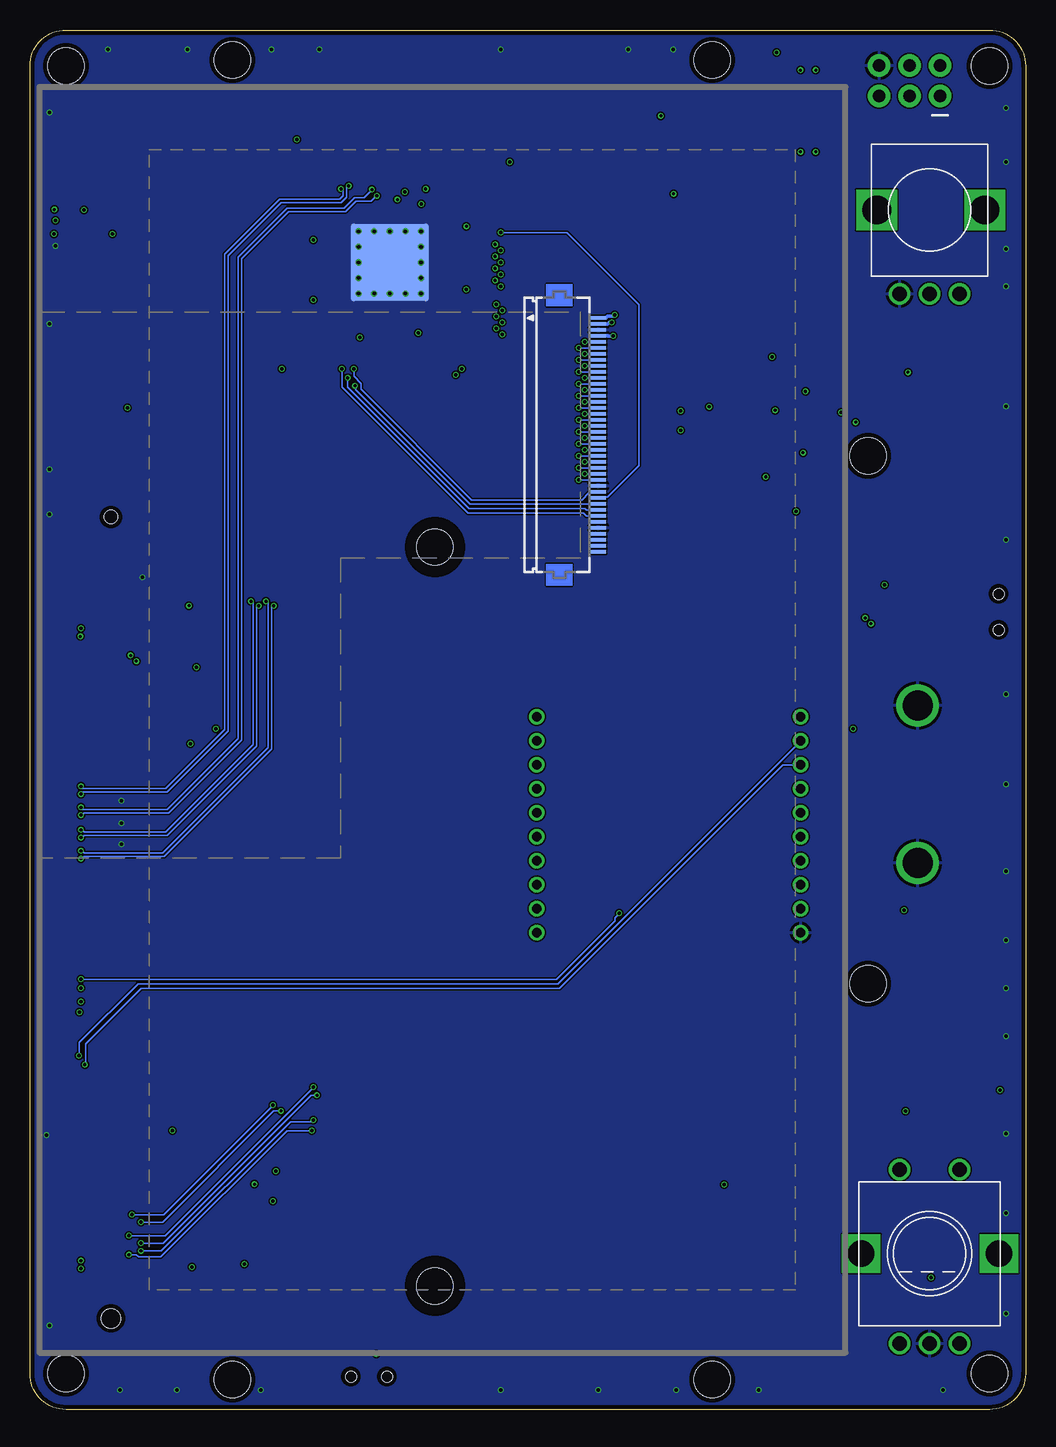
[diagram p6: board, bottom side, seen from below]

Size 83 x 115 mm. Coordinates in mm from the lower left corner, seen from the top.
Outline: 83,3 83,112 arc90 80,115 3,115 arc90 0,112 0,3 arc90 3,0 80,0 arc90 83,3
Copper layers (1*2+15*16): Top 0.0356mm / dielectric 0.2mm / Route2 0.0356mm / dielectric 0.15mm / Route15 0.0356mm / dielectric 0.2mm / Bottom 0.0356mm
Design rules "LaenPCBOrder-4layer *": minimum track width 5mil, minimum drill 10mil, track to track 5mil, track to pad 5mil, pad to pad 5mil, via to via 5mil, smd to smd 5mil, copper to edge 15mil, drill to drill 6mil, minimum pad ring 4mil, minimum via ring 4mil, stop-mask expansion 4mil, vias tented up to drill 25mil, thermal gap 10mil
Holes 3 mm at 3,3 80,3 80,112 3,112 26.12,112.5 66.12,112.5 66.12,2.5 26.12,2.5 13.12,79.5 13.12,35.5

### Footprints (pad centres in the part's own frame; a part is rotated, then mirrored left to right if it is on the bottom)
BATTCON_12MM = smd 8 x 8: GND 0,0 | smd 3.175 x 3.175: PWR@1 -7.874,0; PWR@2 7.874,0
EIA3216 = smd 1.4 x 1.6: + 1.4,0; - -1.4,0
0603 = smd 1.1 x 1: 1 -0.85,0; 2 0.85,0
EIA3528 = smd 1.2 x 2.5: A 1.65,0; C -1.65,0
SOD323 = smd 0.625 x 0.83: A 1.113,0; K -1.113,0
LED-0603 = smd 1 x 1: A -0.877,0; C 0.877,0
MOLEX_MICRO_SD_104031 = smd 0.85 x 1.1: 1 3.105,0.55; 2 2.005,0.55; 3 0.905,0.55; 4 -0.195,0.55; 5 -1.295,0.55; 6 -2.395,0.55; 7 -3.495,0.55 | smd 0.75 x 1.1: 8 -4.545,0.55 | smd 1.27 x 0.635: CD1 6,10; CD2 6,7 | smd 1.17 x 1.8: SH@1 -5.755,0.9 | smd 1.55 x 1.35: SH@2 5.565,0.675 | smd 1.9 x 1.35: SH@3 -3.73,11.075; SH@4 2.24,11.075
2X3 = drill 1.016 pad 1.88: 1 0,0; 2 0,2.54; 3 2.54,0; 4 2.54,2.54; 5 5.08,0; 6 5.08,2.54
INDUCTOR_SMD_4X4MM = smd 1.5 x 3.6: 1 -1.525,0; 2 1.525,0
SOT523-3 = smd 0.4 x 0.51: 1 -0.5,-0.65; 2 0,0.65; 3 0.5,-0.65
SWITCH_SPST_SMD_A = smd 0.7 x 1.5: 1 -2.25,-1.75; 2 -0.75,-1.75; 3 2.25,-1.75 | smd 1 x 0.6: GND1 -3.65,1; GND3 3.65,1 | smd 1 x 0.8: GND2 -3.65,-1.1; GND4 3.65,-1.1 | hole 0.9: -1.5,0; 1.5,0
PAD.03X.05 = smd 1.27 x 1.27: P$1 0,0
AMP_1473149 = smd 0.35 x 2: 1 -31.65,-4.1; 2 -31.35,4.1; 3 -31.05,-4.1; 4 -30.75,4.1; 5 -30.45,-4.1; 6 -30.15,4.1; 7 -29.85,-4.1; 8 -29.55,4.1; 9 -29.25,-4.1; 10 -28.95,4.1; 11 -28.65,-4.1; 12 -28.35,4.1; 13 -28.05,-4.1; 14 -27.75,4.1; 15 -27.45,-4.1; 16 -27.15,4.1; 17 -26.85,-4.1; 18 -26.55,4.1; 19 -26.25,-4.1; 20 -25.95,4.1; 21 -25.65,-4.1; 22 -25.35,4.1; 23 -25.05,-4.1; 24 -24.75,4.1; 25 -24.45,-4.1; 26 -24.15,4.1; 27 -23.85,-4.1; 28 -23.55,4.1; 29 -23.25,-4.1; 30 -22.95,4.1; 31 -22.65,-4.1; 32 -22.35,4.1; 33 -22.05,-4.1; 34 -21.75,4.1; 35 -21.45,-4.1; 36 -21.15,4.1; 37 -20.85,-4.1; 38 -20.55,4.1; 39 -20.25,-4.1; 40 -19.95,4.1; 41 -16.05,-4.1; 42 -15.75,4.1; 43 -15.45,-4.1; 44 -15.15,4.1; 45 -14.85,-4.1; 46 -14.55,4.1; 47 -14.25,-4.1; 48 -13.95,4.1; 49 -13.65,-4.1; 50 -13.35,4.1; 51 -13.05,-4.1; 52 -12.75,4.1; 53 -12.45,-4.1; 54 -12.15,4.1; 55 -11.85,-4.1; 56 -11.55,4.1; 57 -11.25,-4.1; 58 -10.95,4.1; 59 -10.65,-4.1; 60 -10.35,4.1; 61 -10.05,-4.1; 62 -9.75,4.1; 63 -9.45,-4.1; 64 -9.15,4.1; 65 -8.85,-4.1; 66 -8.55,4.1; 67 -8.25,-4.1; 68 -7.95,4.1; 69 -7.65,-4.1; 70 -7.35,4.1; 71 -7.05,-4.1; 72 -6.75,4.1; 73 -6.45,-4.1; 74 -6.15,4.1; 75 -5.85,-4.1; 76 -5.55,4.1; 77 -5.25,-4.1; 78 -4.95,4.1; 79 -4.65,-4.1; 80 -4.35,4.1; 81 -4.05,-4.1; 82 -3.75,4.1; 83 -3.45,-4.1; 84 -3.15,4.1; 85 -2.85,-4.1; 86 -2.55,4.1; 87 -2.25,-4.1; 88 -1.95,4.1; 89 -1.65,-4.1; 90 -1.35,4.1; 91 -1.05,-4.1; 92 -0.75,4.1; 93 -0.45,-4.1; 94 -0.15,4.1; 95 0.15,-4.1; 96 0.45,4.1; 97 0.75,-4.1; 98 1.05,4.1; 99 1.35,-4.1; 100 1.65,4.1; 101 1.95,-4.1; 102 2.25,4.1; 103 2.55,-4.1; 104 2.85,4.1; 105 3.15,-4.1; 106 3.45,4.1; 107 3.75,-4.1; 108 4.05,4.1; 109 4.35,-4.1; 110 4.65,4.1; 111 4.95,-4.1; 112 5.25,4.1; 113 5.55,-4.1; 114 5.85,4.1; 115 6.15,-4.1; 116 6.45,4.1; 117 6.75,-4.1; 118 7.05,4.1; 119 7.35,-4.1; 120 7.65,4.1; 121 7.95,-4.1; 122 8.25,4.1; 123 8.55,-4.1; 124 8.85,4.1; 125 9.15,-4.1; 126 9.45,4.1; 127 9.75,-4.1; 128 10.05,4.1; 129 10.35,-4.1; 130 10.65,4.1; 131 10.95,-4.1; 132 11.25,4.1; 133 11.55,-4.1; 134 11.85,4.1; 135 12.15,-4.1; 136 12.45,4.1; 137 12.75,-4.1; 138 13.05,4.1; 139 13.35,-4.1; 140 13.65,4.1; 141 13.95,-4.1; 142 14.25,4.1; 143 14.55,-4.1; 144 14.85,4.1; 145 15.15,-4.1; 146 15.45,4.1; 147 15.75,-4.1; 148 16.05,4.1; 149 16.35,-4.1; 150 16.65,4.1; 151 16.95,-4.1; 152 17.25,4.1; 153 17.55,-4.1; 154 17.85,4.1; 155 18.15,-4.1; 156 18.45,4.1; 157 18.75,-4.1; 158 19.05,4.1; 159 19.35,-4.1; 160 19.65,4.1; 161 19.95,-4.1; 162 20.25,4.1; 163 20.55,-4.1; 164 20.85,4.1; 165 21.15,-4.1; 166 21.45,4.1; 167 21.75,-4.1; 168 22.05,4.1; 169 22.35,-4.1; 170 22.65,4.1; 171 22.95,-4.1; 172 23.25,4.1; 173 23.55,-4.1; 174 23.85,4.1; 175 24.15,-4.1; 176 24.45,4.1; 177 24.75,-4.1; 178 25.05,4.1; 179 25.35,-4.1; 180 25.65,4.1; 181 25.95,-4.1; 182 26.25,4.1; 183 26.55,-4.1; 184 26.85,4.1; 185 27.15,-4.1; 186 27.45,4.1; 187 27.75,-4.1; 188 28.05,4.1; 189 28.35,-4.1; 190 28.65,4.1; 191 28.95,-4.1; 192 29.25,4.1; 193 29.55,-4.1; 194 29.85,4.1; 195 30.15,-4.1; 196 30.45,4.1; 197 30.75,-4.1; 198 31.05,4.1; 199 31.35,-4.1; 200 31.65,4.1 | smd 4.5 x 4.6: M1 -32.55,12; M2 32.55,12 | hole 1.6: -33.4,0 | hole 1.1: 33.4,0 | hole 3: -30.7,27; 30.9,27
TQFP100_POWER_LITE = smd 1.6 x 0.3: 1 -7.6,6; 2 -7.6,5.5; 3 -7.6,5; 4 -7.6,4.5; 5 -7.6,4; 6 -7.6,3.5; 7 -7.6,3; 8 -7.6,2.5; 9 -7.6,2; 10 -7.6,1.5; 11 -7.6,1; 12 -7.6,0.5; 13 -7.6,0; 14 -7.6,-0.5; 15 -7.6,-1; 16 -7.6,-1.5; 17 -7.6,-2; 18 -7.6,-2.5; 19 -7.6,-3; 20 -7.6,-3.5; 21 -7.6,-4; 22 -7.6,-4.5; 23 -7.6,-5; 24 -7.6,-5.5; 25 -7.6,-6; 51 7.6,-6; 52 7.6,-5.5; 53 7.6,-5; 54 7.6,-4.5; 55 7.6,-4; 56 7.6,-3.5; 57 7.6,-3; 58 7.6,-2.5; 59 7.6,-2; 60 7.6,-1.5; 61 7.6,-1; 62 7.6,-0.5; 63 7.6,0; 64 7.6,0.5; 65 7.6,1; 66 7.6,1.5; 67 7.6,2; 68 7.6,2.5; 69 7.6,3; 70 7.6,3.5; 71 7.6,4; 72 7.6,4.5; 73 7.6,5; 74 7.6,5.5; 75 7.6,6 | smd 0.3 x 1.6: 26 -6,-7.6; 27 -5.5,-7.6; 28 -5,-7.6; 29 -4.5,-7.6; 30 -4,-7.6; 31 -3.5,-7.6; 32 -3,-7.6; 33 -2.5,-7.6; 34 -2,-7.6; 35 -1.5,-7.6; 36 -1,-7.6; 37 -0.5,-7.6; 38 0,-7.6; 39 0.5,-7.6; 40 1,-7.6; 41 1.5,-7.6; 42 2,-7.6; 43 2.5,-7.6; 44 3,-7.6; 45 3.5,-7.6; 46 4,-7.6; 47 4.5,-7.6; 48 5,-7.6; 49 5.5,-7.6; 50 6,-7.6; 76 6,7.6; 77 5.5,7.6; 78 5,7.6; 79 4.5,7.6; 80 4,7.6; 81 3.5,7.6; 82 3,7.6; 83 2.5,7.6; 84 2,7.6; 85 1.5,7.6; 86 1,7.6; 87 0.5,7.6; 88 0,7.6; 89 -0.5,7.6; 90 -1,7.6; 91 -1.5,7.6; 92 -2,7.6; 93 -2.5,7.6; 94 -3,7.6; 95 -3.5,7.6; 96 -4,7.6; 97 -4.5,7.6; 98 -5,7.6; 99 -5.5,7.6; 100 -6,7.6 | drill 0.3: TH21 -2.6,2.6; TH22 -1.3,2.6; TH23 0,2.6; TH24 1.3,2.6; TH25 2.6,2.6; TH30 -2.6,1.3; TH34 2.6,1.3; TH39 -2.6,0; TH43 2.6,0; TH48 -2.6,-1.3; TH52 2.6,-1.3; TH57 -2.6,-2.6; TH58 -1.3,-2.6; TH59 0,-2.6; TH60 1.3,-2.6; TH61 2.6,-2.6 | smd 6.5 x 6.5: THA 0,0 | smd 6.5 x 6.5 bottom: THB 0,0
HIROSE_FFC40_FH12-40S-0.5SH = smd 0.3 x 1.3: 1 -9.75,3.25; 2 -9.25,3.25; 3 -8.75,3.25; 4 -8.25,3.25; 5 -7.75,3.25; 6 -7.25,3.25; 7 -6.75,3.25; 8 -6.25,3.25; 9 -5.75,3.25; 10 -5.25,3.25; 11 -4.75,3.25; 12 -4.25,3.25; 13 -3.75,3.25; 14 -3.25,3.25; 15 -2.75,3.25; 16 -2.25,3.25; 17 -1.75,3.25; 18 -1.25,3.25; 19 -0.75,3.25; 20 -0.25,3.25; 21 0.25,3.25; 22 0.75,3.25; 23 1.25,3.25; 24 1.75,3.25; 25 2.25,3.25; 26 2.75,3.25; 27 3.25,3.25; 28 3.75,3.25; 29 4.25,3.25; 30 4.75,3.25; 31 5.25,3.25; 32 5.75,3.25; 33 6.25,3.25; 34 6.75,3.25; 35 7.25,3.25; 36 7.75,3.25; 37 8.25,3.25; 38 8.75,3.25; 39 9.25,3.25; 40 9.75,3.25
SOIC8-5.4 = smd 0.55 x 1.5: 1 -1.905,-3.4; 2 -0.635,-3.4; 3 0.635,-3.4; 4 1.905,-3.4; 5 1.905,3.4; 6 0.635,3.4; 7 -0.635,3.4; 8 -1.905,3.4
SOT353-5 = smd 0.4 x 0.9: 1 -0.65,-1.1; 2 0,-1.1; 3 0.65,-1.1; 4 0.65,1.1; 5 -0.65,1.1
WDFN12 = smd 1 x 0.25: 1 -1.7,1.125; 2 -1.7,0.675; 3 -1.7,0.225; 4 -1.7,-0.225; 5 -1.7,-0.675; 6 -1.7,-1.125; 7 1.7,-1.125; 8 1.7,-0.675; 9 1.7,-0.225; 10 1.7,0.225; 11 1.7,0.675; 12 1.7,1.125 | smd 1.7 x 2.5: TH 0,0
SOT23-6 = smd 0.55 x 1: 1 -0.95,-1.35; 2 0,-1.35; 3 0.95,-1.35; 4 0.95,1.35; 5 0,1.35; 6 -0.95,1.35
SOT23-5 = smd 0.55 x 1: 1 -0.95,-1.35; 2 0,-1.35; 3 0.95,-1.35; 4 0.95,1.35; 5 -0.95,1.35
MSOP10 = smd 0.3 x 1.4: 1 -1,-2.2; 2 -0.5,-2.2; 3 0,-2.2; 4 0.5,-2.2; 5 1,-2.2; 6 1,2.2; 7 0.5,2.2; 8 0,2.2; 9 -0.5,2.2; 10 -1,2.2
SOIC16W = smd 0.55 x 2: 1 -4.445,-4.685; 2 -3.175,-4.685; 3 -1.905,-4.685; 4 -0.635,-4.685; 5 0.635,-4.685; 6 1.905,-4.685; 7 3.175,-4.685; 8 4.445,-4.685; 9 4.445,4.685; 10 3.175,4.685; 11 1.905,4.685; 12 0.635,4.685; 13 -0.635,4.685; 14 -1.905,4.685; 15 -3.175,4.685; 16 -4.445,4.685
BOURNS_PEC11L = drill 1.2: 1 -2.5,7; 2 2.5,7; A -2.5,-7.5; B 2.5,-7.5; C 0,-7.5 | drill 2.2 square: CH@1 -5.7,0; CH@2 5.8,0
FCI_USB_A_87583 = smd 1.12 x 2.88: D+ 1,3.58; D- -1,3.58; GND 3.5,3.58; VBUS -3.5,3.58 | drill 2.5 pad 3: SH@1 -6.57,0; SH@2 6.57,0
USB_MICRO_B_TYCO = smd 0.4 x 1.35: 1 -1.3,2.85; 2 -0.65,2.85; 3 0,2.85; 4 0.65,2.85; 5 1.3,2.85 | smd 1.3 x 1.3: SH@1 3.35,0; SH@2 -3.35,0 | smd 1.6 x 1.4: SH@3 3.2,2.45; SH@4 -3.2,2.45
BOURNS_PTV09A = drill 1.2: 1 -2.5,-7; 2 0,-7; 3 2.5,-7 | drill 2.4 square: CH@1 -4.4,0; CH@2 4.6,0
XBEE-PRO = drill 0.8 pad 1.27: 1 -11,9; 2 -11,7; 3 -11,5; 4 -11,3; 5 -11,1; 6 -11,-1; 7 -11,-3; 8 -11,-5; 9 -11,-7; 10 -11,-9; 11 11,-9; 12 11,-7; 13 11,-5; 14 11,-3; 15 11,-1; 16 11,1; 17 11,3; 18 11,5; 19 11,7; 20 11,9

### Placement (x,y rotation side)
BT1  35.75,7.38 180 top
C1  19.12,74.88 0 top
C2  21.12,87.75 180 top
C3  19.12,77.75 0 top
C4  21.12,84.88 180 top
C5  2.12,89 90 top
C6  24.5,100.38 90 top
C7  22.62,109.5 270 top
C8  67.88,60 180 top
C9  25.12,20.88 90 top
C10  9.5,69.5 270 top
C11  67.88,63 180 top
C12  67.88,66 180 top
C13  67.88,69 180 top
C14  4.25,89 90 top
C15  61.38,104 315 top
C16  44.62,104 45 top
C17  61.38,87.25 225 top
C18  22.38,69.75 270 top
C19  27.25,69.75 270 top
C20  32.12,69.75 270 top
C21  68.88,23.25 180 top
C22  69.5,14.25 90 top
D1  24.5,105 90 top
D2  2.12,37.75 180 top
D3  2.12,33.75 180 top
D4  2.12,29.75 180 top
D5  2.12,41.75 180 top
D6  2.12,25.75 180 top
J1  82.5,99.5 90 top
J3  7.12,109.5 0 top
L1  24.5,76.25 270 top
L2  15.75,86.25 90 top
L3  28.88,105.5 180 top
Q1  66.75,12.62 270 top
Q2  66.75,15.38 270 top
R1  8.5,89 90 top
R2  6.38,89 90 top
R3  68.88,19.62 0 top
R4  63.25,13.12 0 top
R5  63.25,15.88 180 top
R6  7.88,9 90 top
R7  10.38,9 270 top
R8  68.88,17.5 0 top
R9  68.5,37.88 0 top
R10  68.5,35.75 0 top
R11  41.62,19.12 90 top
R12  38.75,19.12 90 top
R13  28.88,98.62 180 top
R14  11.38,64.5 0 top
R15  5.38,9 270 top
R16  8.12,37.75 0 top
R17  8.12,33.75 0 top
R18  8.25,29.75 0 top
R19  8.12,41.75 0 top
R20  8.25,25.75 0 top
R21  69,52.38 270 top
R22  66.75,52.38 270 top
S1  2.25,66.5 90 top
S2  54.75,2.75 180 top
TP_1V8  29.62,82.5 0 top
TP_3V3  29.62,84.12 0 top
TP_5V0  29.62,85.75 0 top
TP_BKL_LED_A  27,95.62 0 top
TP_BKL_LED_K  27,97.12 0 top
TP_GND  29.62,87.38 0 top
U1  76.25,41 90 top
U2  53,95.62 0 top
U3  38.88,81.25 270 bottom
U4  18.12,109.5 0 top
U5  28.88,101.38 270 top
U6  20,81.38 0 top
U7  7.38,85.5 270 top
U8  67.88,56.75 0 top
U9  12.38,69.5 0 top
U10  32,20.88 0 top
U11  74.88,83.5 90 top
U12  8,80.38 270 top
U$1  8,13 0 bottom
U$4  46.12,57.5 270 bottom
USB_A  9,52.12 270 top
USB_B_1  1.62,78 270 top
USB_B_2  81.5,83.88 90 top
VR1  8,100 0 bottom
XB1  29.75,48.75 0 top

### Tracks (layer width: path | path; a pad name or v marks a point on that pad's centre or on a via)
B0  (via drill 0.25)
  Top 0.127: U2.10 v44.21,97.12
  Route2 0.127: v44.21,97.12 43.42,97.12 40.68,94.38 40.68,81.62 40.05,81 v36.75,81
  Bottom 0.127: v36.75,81 U3.21
B1  (via drill 0.25)
  Top 0.127: U2.11 v43.75,96.62
  Route2 0.127: v43.75,96.62 43.58,96.45 43.26,96.45 41.01,94.2 41.01,81 40.51,80.5 v37.25,80.5
  Bottom 0.127: v37.25,80.5 U3.22
B2  (via drill 0.25)
  Top 0.127: U2.12 v44.21,96.12
  Route2 0.127: v44.21,96.12 43.4,96.12 41.34,94.06 41.34,80.5 40.84,80 v36.75,80
  Bottom 0.127: v36.75,80 U3.23
B3  (via drill 0.25)
  Top 0.127: U2.13 v43.75,95.62
  Route2 0.127: v43.75,95.62 43.58,95.45 43.2,95.45 41.67,93.92 41.67,80.12 41.05,79.5 v37.25,79.5
  Bottom 0.127: v37.25,79.5 U3.24
B4  (via drill 0.25)
  Top 0.127: U2.14 v44.21,95.12
  Route2 0.127: v44.21,95.12 43.34,95.12 42,93.79 42,79.88 41.13,79 v36.75,79
  Bottom 0.127: v36.75,79 U3.25
B5  (via drill 0.25)
  Top 0.127: U2.15 v43.75,94.62
  Route2 0.127: v43.75,94.62 43.7,94.58 43.27,94.58 42.34,93.65 42.34,79.38 41.46,78.5 v37.25,78.5
  Bottom 0.127: v37.25,78.5 U3.26
B6  (via drill 0.25)
  Top 0.127: U2.16 v44.21,94.12
  Route2 0.127: v44.21,94.12 43.28,94.12 42.67,93.51 42.67,78.88 41.79,78 v36.75,78
  Bottom 0.127: v36.75,78 U3.27
B7  (via drill 0.25)
  Top 0.127: U2.17 v43.75,93.62
  Route2 0.127: v43.75,93.62 43.25,93.62 43,93.38 43,78.62 41.88,77.5 v37.25,77.5
  Bottom 0.127: v37.25,77.5 U3.28
BKL_ADJ  (via drill 0.25)
  Top 0.127: v17.49,104.85 U4.2
  Route2 0.127: VR1.2 8,100.04 10.87,102.85 16.49,102.85 17.49,103.85 v17.49,104.85
BKL_LED_A  (via drill 0.25)
  Top 0.305: D1.K C6.+ 23,100.28 | v34.5,90.62 34.38,90.5 30.76,90.5 26.32,94.94 | 23,100.28 | 23,100.28 23,98.26 26.32,94.94 | TP_BKL_LED_A.P$1 26.32,94.94
  Bottom 0.305: v34.5,90.62 34.75,90.62 34.88,90.5 U3.2
BKL_LED_K  (via drill 0.25)
  Top 0.305: U5.3 27.77,98.88 R13.2 28.02,97.12 | v34.25,91.25 34,91 31,91 28.02,93.97 28.02,96 28.02,97.12 | TP_BKL_LED_K.P$1 28.02,97.12
  Bottom 0.305: v34.25,91.25 34.37,91.13 34.85,91.13 34.99,91 U3.1
BKL_MISO  (via drill 0.25)
  Top 0.127: v18.76,111.65 U4.6
  Route2 0.127: J3.1 8.38,108.25 15.62,108.25 18.76,111.39 v18.76,111.65
BKL_MOSI  (via drill 0.25)
  Top 0.127: U4.5 20.19,113.12 v20.75,113.12
  Route2 0.127: J3.4 11.28,113.65 20.23,113.65 v20.75,113.12
BKL_PWM  (via drill 0.25)
  Top 0.127: v29.35,101.35 U5.4 | U4.3 v18.76,104.85
  Route2 0.127: v29.35,101.35 21.27,101.35 18.76,103.86 v18.76,104.85
BKL_RST
  Top 0.127: U4.1 15.61,106.1 J3.5
BKL_SCK  (via drill 0.25)
  Top 0.127: v17.49,111.65 U4.7
  Route2 0.127: J3.3 10.91,110.75 17,110.75 17.49,111.24 v17.49,111.65
DE  (via drill 0.25)
  Top 0.127: v57,86.75 U2.46
  Bottom 0.127: v57,86.75 57,85.25 46.5,74.75 36.84,74.75 36.59,74.5 U3.34
EMMC_DISABLE
  Top 0.127: Q1.2 70.38,9.65 U1.2
EMMC_EN
  Top 0.127: R5.1 Q2.1 66.1,38.6 67.15,39.65 U1.90
EN_1V8  (via drill 0.25)
  Top 0.127: R2.1 7.12,87.4 7.12,86.5 8.12,85.5 8.75,85.5 U7.5 12,85.5 13.88,83.62 14.88,83.62 v15.38,83.12 | v20.88,83.31 21.19,83.31 21.7,82.8 U6.12
  Route2 0.127: v20.88,83.31 15.56,83.31 v15.38,83.12
EN_3V3  (via drill 0.25)
  Top 0.127: U6.6 18.56,79.99 v18.56,79.77 | v9.8,86.47 8.75,86.47 U7.6 8.72,87.92 R1.1
  Route2 0.127: v18.56,79.77 17.73,79.77 11.05,86.45 v9.8,86.47
ENC_A  (via drill 0.25)
  Top 0.127: R7.2 10.5,8.03 U$1.A | v78.88,33.12 79,33.12 79.25,33.38 80.33,33.38 U1.69
  Route2 0.127: v78.88,33.12 78.12,33.12 77.88,33.38 48.75,33.38 21.79,6.42 11.42,6.42 U$1.A
ENC_B  (via drill 0.25)
  Top 0.127: R15.2 5.5,8.03 U$1.B | v78.75,34 78.8,33.95 U1.71
  Route2 0.127: U$1.B 6.75,6.75 21.66,6.75 48.61,33.71 77.71,33.71 78,34 v78.75,34
ENC_SW  (via drill 0.25)
  Top 0.127: v78.75,35.12 80.33,35.12 U1.75 | v7.88,11 R6.2
  Route2 0.127: U$1.1 7.88,17.38 v7.88,11 7.88,8.5 9.29,7.08 10.5,7.08 21.52,7.08 34.53,20.09 48.48,34.04 77.04,34.04 78.12,35.12 v78.75,35.12
G0  (via drill 0.25)
  Top 0.127: U2.20 v44.12,92.12
  Route15 0.127: v44.12,92.12 43.15,92.12 41.22,90.19 41.22,86.12 40.09,85 v36.75,85
  Bottom 0.127: v36.75,85 U3.13
G1  (via drill 0.25)
  Top 0.127: U2.21 v43.62,91.62
  Route15 0.127: v43.62,91.62 43.12,91.62 41.55,90.05 41.55,85.86 40.19,84.5 v37.25,84.5
  Bottom 0.127: v37.25,84.5 U3.14
G2  (via drill 0.25)
  Top 0.127: U2.22 v44.12,91.12
  Route15 0.127: v44.12,91.12 43.15,91.12 41.88,89.85 41.88,85.5 40.38,84 v36.75,84
  Bottom 0.127: v36.75,84 U3.15
G3  (via drill 0.25)
  Top 0.127: U2.23 v43.62,90.62
  Route15 0.127: v37.25,83.5 40.84,83.5 42.21,84.88 42.21,89.71 43.25,90.75 43.5,90.75 v43.62,90.62
  Bottom 0.127: v37.25,83.5 U3.16
G4  (via drill 0.25)
  Top 0.127: U2.24 v44.12,90.12
  Route15 0.127: v44.12,90.12 43.29,90.12 42.54,89.37 42.54,84.25 41.29,83 v36.75,83
  Bottom 0.127: v36.75,83 U3.17
G5  (via drill 0.25)
  Top 0.127: U2.25 v43.62,89.62
  Route15 0.127: v43.62,89.62 43.27,89.62 42.88,89.23 42.88,84.11 41.63,82.87 41.26,82.5 v37.25,82.5
  Bottom 0.127: v37.25,82.5 U3.18
G6  (via drill 0.25)
  Top 0.127: U2.26 v47,86.75
  Route15 0.127: v47,86.75 47,86.25 42.75,82 v36.75,82
  Bottom 0.127: v36.75,82 U3.19
G7  (via drill 0.25)
  Top 0.127: U2.27 v47.5,86.25
  Route15 0.127: v37.25,81.5 42.72,81.5 47.47,86.25 v47.5,86.25
  Bottom 0.127: v37.25,81.5 U3.20
GND  (via drill 0.25)
  Top 0.305: C4.- 22.99,84.41 22.99,81.6 22.54,81.15 U6.9 20.23,81.15 U6.TH 19.77,81.6 U6.3 17.49,81.6 17.47,81.61 17.24,81.38 17.01,81.15 17.01,79.8 17.73,79.08 C3.- | C6.- 24.6,98.97 27,101.38 U5.2 28.5,101.38 28.88,101 28.88,99.47 R13.1 | R6.1 8,8.03 U$1.C | U9.5 13.38,68.5 11.53,70.35 C10.1 10.85,71.7 U9.10 | R4.1 64.15,14.88 Q2.3 | C8.2 67.03,58.2 U8.5 | USB_B_2.SH@3 79.05,85.58 USB_B_2.5 78.56,85.08 77.45,85.08 76.82,84.45 U11.3 U11.2 | U12.2 U12.3 | U2.19 50,92.62 U2.TH57 48,90.62 U2.28 | U2.39 53.5,92.53 U2.TH59 | U2.68 55.7,98.12 U2.TH25 | U2.83 55.5,98.33 U2.TH25 | U2.58 55.7,93.12 U2.TH61 | U2.45 56.5,92.12 U2.TH61 | 49,99.62 U2.TH21 | U2.1 47,101.62 | 47,101.62 47.12,101.5 | 47.12,101.5 48.44,100.19 | 48.44,100.19 49,99.62 | U2.4 48.5,100.12 49,99.62 | U2.98 48,100.62 48.44,100.19 | U2.100 47,101.62 | U2.76 59,102.12 59,102 | 59,101.62 57.38,100 U2.TH25 | U2.92 51,98.92 U2.TH22 | C16.2 45.23,103.4 47.12,101.5 | C15.2 60.77,103.4 59,101.62 | C17.2 60.77,87.85 56.63,91.99 56.54,91.99 56.24,92.29 56.24,92.38 U2.TH61 | U2.5 49,99.62 | U2.89 52.5,102.38 53,101.88 | U2.87 53.5,102.38 53,101.88 | 53,101.88 U2.TH23 | U2.79 57.5,102.38 57.88,102 59,102 | 59,102 59,101.62 | J1.6 80.98,97.11 v80.88,97 | U4.4 20.85,106.1 22.62,107.88 C7.2
  other vias: 73.62,69.38 75.38,50.75 75.38,48.88 75.38,47.12 1.62,108.5 1.62,104 1.62,96.75 1.62,93.62 1.62,83.62 1.62,72.5 1.62,59.62 1.62,52.12 1.62,44.88 1.62,39.12 1.62,35.12 1.62,31.12 1.62,23 1.62,16.38 1.62,8 6.88,1.62 22.25,1.62 35.62,1.62 43.75,1.62 29.12,1.62 63.75,1.62 70.75,1.62 75.5,1.62 81.38,7 81.62,22.88 81.38,74.62 81.38,78.38 81.38,90.5 81.38,108.12 76.5,113.38 69.88,113.38 62.88,113.38 58.88,113.38 29.38,113.38 33.12,113.38 43.75,113.38
  pour Top: 0,0 0,115 83,115 83,0
  pour Bottom: 0,0 83,0 83,115.38 0,115.38
HDMI_CLK_N  (via drill 0.25)
  Top 0.127: v78.75,45.92 80.32,45.92 U1.111 | v50,101.75 U2.94
  Route2 0.127: 62.83,97.81 62.83,68.05 62.83,67.88 62.83,67 v62.67,67 | 61.43,99.21 | 62.83,97.81 | 62.83,97.81 61.43,99.21 | v50,101.75 50,100.83 49.88,100.71 49.88,100.28 50.95,99.21 61.43,99.21
  Bottom 0.127: v62.67,67 62.83,67 62.83,66.88 62.83,55.62 62.83,55.06 71.13,46.76 71.81,46.08 78.5,46.08 78.67,45.92 v78.75,45.92
HDMI_CLK_P  (via drill 0.25)
  Top 0.127: v78.75,46.58 78.75,46.42 78.88,46.42 79.17,46.42 79.25,46.5 80.3,46.5 U1.113 | v50.38,100.5 50.5,100.62 U2.93
  Route2 0.127: 52.57,99.54 53.12,99.54 61.57,99.54 63.17,97.94 | 63.17,97.94 | 63.17,97.94 63.17,68 | 63.17,68 | 63.17,68 63.17,67.83 63.17,67.38 v63.33,67.38 | 52.57,99.54 | 52.57,99.54 | 52.57,99.54 51.08,99.54 50.38,100.25 v50.38,100.5
  Bottom 0.127: v63.33,67.38 63.17,67.38 63.17,66.88 | 63.17,66.88 | 63.17,66.88 63.17,55.62 63.17,55.19 71.37,46.99 71.94,46.42 78.5,46.42 78.67,46.58 v78.75,46.58
HDMI_D0_N  (via drill 0.25)
  Top 0.127: v78.75,47.67 78.83,47.75 U1.117 | v51.75,101.5 51.75,102 51.5,102.25 U2.91
  Route2 0.127: 61.5,99.96 53.18,99.96 52.56,99.96 51.75,100.77 v51.75,101.5 | 61.5,99.96 | 61.5,99.96 62,99.96 62.18,99.96 64.08,98.06 64.08,67 v63.92,67
  Bottom 0.127: v63.92,67 64.08,67 64.08,66.75 64.08,55.31 71.13,48.26 71.56,47.83 78.5,47.83 78.67,47.67 v78.75,47.67
HDMI_D0_P  (via drill 0.25)
  Top 0.127: v78.75,48.33 78.75,48.17 78.88,48.17 79.04,48.17 79.25,48.38 80.33,48.38 U1.119 | v52.37,100.87 52.37,101.88 52,102.25 U2.90
  Route2 0.127: 53.32,100.29 61.5,100.29 62,100.29 62.32,100.29 64.42,98.19 64.42,67.38 v64.58,67.38 | 53.32,100.29 | 53.32,100.29 52.94,100.29 v52.37,100.87
  Bottom 0.127: v64.58,67.38 64.42,67.38 64.42,66.75 64.42,55.44 71.37,48.49 | 71.37,48.49 | 71.37,48.49 71.69,48.17 78.5,48.17 78.67,48.33 v78.75,48.33
HDMI_D1_N  (via drill 0.25)
  Top 0.127: v78.75,49.54 U1.123 | v54.08,101.18 54,101.27 54,101.5 U2.86
  Bottom 0.127: v54.08,101.18 54.56,100.71 55.81,100.71 56.68,99.83 61.43,99.83 65.33,95.93 65.33,55.81 71.43,49.71 78.5,49.71 78.67,49.54 v78.75,49.54 | v54.08,101.18
HDMI_D1_P  (via drill 0.25)
  Top 0.127: U2.85 54.5,102.12 v54.5,101.71 v54.5,101.7 | v78.75,50.21 78.75,50.04 78.88,50.04 79.17,50.04 79.25,50.12 80.33,50.12 U1.125
  Bottom 0.127: v78.75,50.21 78.58,50.04 71.57,50.04 65.67,55.94 65.67,96.07 61.57,100.17 56.82,100.17 55.94,101.04 55.16,101.04 v54.5,101.7
HDMI_D2_N  (via drill 0.25)
  Top 0.127: U2.81 56.58,103.14 56.58,102 v56.42,102 | v78.75,51.29 78.81,51.35 U1.129
  Bottom 0.127: v56.42,102 56.58,102 56.58,101.06 57.06,100.58 58.25,100.58 58.42,100.58 62.06,100.58 65.38,97.26 66.46,96.18 66.46,56.56 71.56,51.46 78.58,51.46 v78.75,51.29
HDMI_D2_P  (via drill 0.25)
  Top 0.127: U2.80 56.92,103.14 56.92,101.75 v57.08,101.75 | v78.75,51.96 78.75,51.79 78.88,51.79 79.04,51.79 79.12,51.88 80.28,51.88 U1.131
  Bottom 0.127: v57.08,101.75 56.92,101.75 56.92,101.19 57.19,100.92 58,100.92 | 58,100.92 | 58,100.92 58.17,100.92 62.19,100.92 65.62,97.49 66.79,96.32 66.79,56.69 71.69,51.79 78.58,51.79 v78.75,51.96
HDMI_EDID_SCL  (via drill 0.25)
  Top 0.127: v67.5,56.75 66.92,56.17 U8.1 66.75,55.23 R22.1 | v78.75,65.12 80.33,65.12 U1.175
  Route2 0.127: v67.5,56.75 70.38,56.75 v78.75,65.12
HDMI_EDID_SDA  (via drill 0.25)
  Top 0.127: v69.62,55.5 69.53,55.4 U8.3 69,55.23 R21.1 | v78.81,64.44 80.24,64.44 U1.173
  Route2 0.127: v69.62,55.5 78.57,64.44 v78.81,64.44
HSYNC  (via drill 0.25)
  Top 0.127: v55.91,85.34 55.95,85.38 56.92,85.38 58,86.45 U2.48
  Bottom 0.127: U3.32 46.31,75.5 55.84,85.03 55.84,85.27 v55.91,85.34
L_BKL
  Top 0.305: U5.1 27.77,105.08 L3.2 26.74,106.11 D1.A
L_VCC_1V8
  Top 0.305: L2.1 15.88,84.6 15.88,83.62 17.45,82.05 U6.2
L_VCC_3V3
  Top 0.305: L1.1 24.5,78.47 22.27,80.7 U6.8
LED_ACT  (via drill 0.25)
  Top 0.127: Q2.2 67.4,13.78 66.75,13.12 66.75,12.5 66.38,12.12 Q1.3 v65.12,12.12 | D6.C v2.12,26.62
  Route15 0.127: v2.12,26.62 46.62,26.62 61.12,12.12 v65.12,12.12
N$17
  Top 0.127: C5.1 2.12,87.38 4.95,84.55 U7.3
N$26
  Top 0.305: U9.2 11.88,65.88 12.25,65.5 12.25,64.53 R14.2 12.22,63.48 11.75,63 9.12,63 7.88,64.25 S1.1
PCLK  (via drill 0.25)
  Top 0.127: v56,86.75 U2.44
  Bottom 0.127: v56,86.75 56,86.13 55.39,85.51 55.39,85.05 46.17,75.83 36.97,75.83 36.39,76.42 35.71,76.42 U3.30
PD_GPIO28
  Top 0.127: R8.2 69.78,17.45 U1.28
PD_GPIO29
  Top 0.127: R3.2 70.62,18.73 70.62,18.38 70.95,18.05 U1.30
PD_GPIO44
  Top 0.127: R10.2 70.85,37.25 U1.82
PD_GPIO45
  Top 0.127: R9.2 72.12,37.88 U1.84
R0  (via drill 0.25)
  Top 0.127: U2.30 49,86.5 48.25,85.75 42.62,85.75 39.38,89 v36.75,89
  Bottom 0.127: v36.75,89 U3.5
R1  (via drill 0.25)
  Top 0.127: U2.31 49.5,86.5 48.38,85.38 42.5,85.38 39.38,88.5 v37.25,88.5
  Bottom 0.127: v37.25,88.5 U3.6
R2  (via drill 0.25)
  Top 0.127: U2.32 50,86.38 48.62,85 42.38,85 39.38,88 v36.75,88
  Bottom 0.127: v36.75,88 U3.7
R3  (via drill 0.25)
  Top 0.127: U2.33 50.5,86.25 48.88,84.62 42.25,84.62 39.38,87.5 v37.25,87.5
  Bottom 0.127: v37.25,87.5 U3.8
R4  (via drill 0.25)
  Top 0.127: U2.34 51,86.12 49.12,84.25 42.12,84.25 39.38,87 v36.75,87
  Bottom 0.127: v36.75,87 U3.9
R5  (via drill 0.25)
  Top 0.127: U2.35 51.5,86.12 49.25,83.88 42,83.88 39.38,86.5 v37.25,86.5
  Bottom 0.127: v37.25,86.5 U3.10
R6  (via drill 0.25)
  Top 0.127: U2.36 52,86.12 49.38,83.5 41.88,83.5 39.38,86 v36.75,86
  Bottom 0.127: v36.75,86 U3.11
R7  (via drill 0.25)
  Top 0.127: U2.37 52.5,86.12 49.5,83.12 41.75,83.12 39.38,85.5 v37.25,85.5
  Bottom 0.127: v37.25,85.5 U3.12
R_POWER
  Top 0.127: R19.1 D5.A
R_SD_ACT
  Top 0.127: D6.A R20.1
R_XBEE_ASSOC
  Top 0.127: D2.A R16.1
R_XBEE_ON
  Top 0.127: D4.A R18.1
R_XBEE_RSSI
  Top 0.127: R17.1 D3.A
RTC_VBAT
  Top 0.305: BT1.PWR@1 36.62,14.38 25.12,14.38 23.5,16 23.5,25.75 26,28.25 29.25,28.25 30.09,27.41 U10.14
RXD0  (via drill 0.25)
  Top 0.127: v78.92,29.5 78.92,28.92 79.33,28.5 80.3,28.5 U1.53
  Bottom 0.127: XB1.2 39,35.5 74,35.5 78.92,30.58 v78.92,29.5
SCDT  (via drill 0.25)
  Top 0.127: v43.75,98.12 U2.8
  Bottom 0.127: U3.31 35.54,76.08 34.86,76.08 32.25,78.69 32.25,92.12 38.25,98.12 v43.75,98.12
SCL1  (via drill 0.25)
  Top 0.127: U10.16 27.55,24.07 31.02,20.6 38.12,20.6 R12.2 38.88,20.1 39.8,20.1 40.75,19.16 63.92,19.16 v64.29,18.79 | v78.75,12.41 80.29,12.41 U1.11
  Route2 0.127: v64.29,18.79 69.6,13.48 70.67,12.41 v78.75,12.41
SD_CLK  (via drill 0.25)
  Top 0.127: v59.5,23.25 59.5,23.3 57.42,25.38 57.42,78.62 75.25,96.45 75.25,97.12 v76.12,98 | v74.75,12.91 73.89,12.05 U1.10 | v81,98 81.75,98 J1.5
  Route2 0.127: v76.12,98 v81,98
  Bottom 0.127: v59.5,23.25 61.56,23.25 72.1,12.72 73.96,12.72 74.15,12.91 v74.75,12.91
SD_CMD  (via drill 0.25)
  Top 0.127: v59.38,24.12 59.38,24.24 57.75,25.86 57.75,27.25 57.75,78.48 77.62,98.35 77.62,99.12 v78.5,100 | v73.75,13.21 73.19,12.65 U1.12 | v80.97,100.03 81.34,100.41 J1.3
  Route2 0.127: v78.5,100 78.53,100.03 v80.97,100.03
  Bottom 0.127: v59.38,24.12 59.5,24 61.28,24 72.07,13.21 v73.75,13.21
SD_D0  (via drill 0.25)
  Top 0.127: v59.06,26.19 58.75,26.5 58.75,78.07 76.44,95.75 81.7,95.75 J1.7 | v73.75,13.88 72.17,13.88 U1.16
  Bottom 0.127: v73.75,13.88 71.88,13.88 59.56,26.19 v59.06,26.19
SD_D1  (via drill 0.25)
  Top 0.127: v59.38,26.88 59.08,27.17 59.08,27.25 59.08,77.93 76.36,95.2 81.7,95.2 J1.8 | v74.75,14.5 72.2,14.5 U1.18
  Bottom 0.127: v59.38,26.88 71.75,14.5 v74.75,14.5
SD_D2  (via drill 0.25)
  Top 0.127: v62.08,24.88 v62.07,24.88 59.21,24.88 58.09,26 58.09,78.34 72.62,92.88 79.88,100.13 79.88,101.5 80.98,102.61 J1.1 | v73.75,15.62 72.17,15.62 U1.22
  Bottom 0.127: v73.75,15.62 71.95,15.62 62.7,24.88 v62.08,24.88
SD_D3  (via drill 0.25)
  Top 0.127: v62.75,25.38 59.18,25.38 58.42,26.13 58.42,78.21 80.26,100.05 80.26,100.94 80.82,101.5 J1.2 | v74.5,16.25 U1.24
  Bottom 0.127: v62.75,25.38 71.88,16.25 v74.5,16.25
SDA1  (via drill 0.25)
  Top 0.127: U10.15 28.82,23.43 31.25,21 39.62,21 40.65,19.98 R11.2 62.4,19.98 v62.5,19.88 | v78.75,11.75 U1.9
  Route2 0.127: v62.5,19.88 70.62,11.75 v78.75,11.75
TXD0  (via drill 0.25)
  Top 0.127: v78.42,28.75 79.17,28 80.3,28 U1.51
  Bottom 0.127: XB1.3 20.25,53.75 38.88,35.12 73.75,35.12 78.38,30.5 78.38,28.79 v78.42,28.75
USB_A_N
  Top 0.127: U9.6 13.29,71.62 13.29,70 13.29,69.69 14.42,68.57 14.42,62.25 | 14.42,62.25 | 14.42,62.25 14.42,60.06 10.12,55.76 | 10.12,55.76 | 10.12,55.76 10.12,53.88 10.75,53.25 10.88,53.12 USB_A.D-
USB_A_P
  Top 0.127: U9.7 12.96,71.62 12.96,70 | 12.96,70 | 12.96,70 12.96,69.56 14.08,68.43 14.08,62.25 14.08,60.19 9.79,55.9 9.79,52.09 10.75,51.12 USB_A.D+
USB_A_VCC
  Top 0.305: USB_B_1.1 5.25,80.08 5.25,80.62 5.95,81.33 U12.1
USB_B_N
  Top 0.127: USB_B_1.2 5.47,78.65 5.79,78.34 9.52,78.34 12.38,75.48 12.38,74.2 U9.8
USB_B_P
  Top 0.127: USB_B_1.3 4.48,78.01 9.38,78.01 11.88,75.52 11.88,74.2 U9.9
USB_B_VCC
  Top 0.305: U11.1 78.62,82.55 USB_B_2.1
USB_BOOT_EN
  Top 0.127: Q1.1 64.12,13.12 | 64.12,13.12 R4.2 | S2.1 57,7.12 61.62,11.75 63.62,11.75 64,12.12 64,13 64.12,13.12
USB_N  (via drill 0.25)
  Top 0.127: U9.4 12.79,67.22 12.79,66.32 13.24,65.87 v13.36,65.98 | v74.61,62.86 74.49,62.74 74.69,62.54 79.19,62.54 79.24,62.59 80.19,62.59 U1.167
  Route2 0.127: v13.36,65.98 13.24,65.87 13.57,65.54 17.25,65.54 71.69,65.54 74.49,62.74 v74.61,62.86
USB_P  (via drill 0.25)
  Top 0.127: U9.3 12.46,67.22 12.46,66.25 | 12.46,66.25 | 12.46,66.25 | v12.89,65.52 13.01,65.63 12.46,66.18 12.46,66.25 | v74.14,62.39 74.26,62.51 74.56,62.21 78,62.21 80.29,62.21 U1.165
  Route2 0.127: v12.89,65.52 13.01,65.63 13.43,65.21 17.25,65.21 71.56,65.21 74.26,62.51 v74.14,62.39
VCC_1V8  (via drill 0.25)
  Top 0.305: L2.2 19.7,87.78 C2.+ | C2.+ 21.12,86.35 21.12,84.2 22.56,82.77 22.56,81.78 22.38,81.6 U6.10 | U1.183 U1.185 76.38,68.15 76.08,68.45 U1.186 U1.184 71.18,67.85 70.75,67.42 70.75,65.03 C11.1 68.72,62.27 v69.12,61.88 | R5.2 62.4,17.02 v62.75,17.38 | TP_1V8.P$1 v28.75,81.62 | C2.+ v21.12,87.75 | S2.2 55.38,4.62 v54.12,4.62
  pour Route15: 0,0 82.75,0 82.75,116.88 0,116.88
VCC_3V3  (via drill 0.25)
  Top 0.305: L1.2 20.68,74.72 C1.+ | C1.+ 19.12,76.28 19.12,78.3 17.44,79.98 17.44,80.97 17.62,81.15 U6.4 | U9.1 11.38,66.25 10.53,65.4 R14.1 | C10.2 10.85,67.3 U9.1 | 28.75,18.27 26.88,18.27 C9.1 v25.12,18.75 | 28.75,18.27 32.12,18.27 R12.1 R11.1 | U10.2 28.82,18.2 28.75,18.27 | U$1.2 5.5,11.88 | 5.5,11.88 5.5,9.97 R15.1 | U1.39 U1.41 76.3,24.95 76,25.25 U1.42 72.15,23.25 | 72.15,23.25 U1.40 | U1.4 U1.6 70.53,10.85 v69.5,11.88 C22.1 | C12.1 v69.74,67.01 70,67.28 70,68.62 71.03,69.65 U1.190 U1.192 | U9.1 11.38,68.38 v11.75,68.75 | 53,104.38 55,104.38 | 55,104.38 56,104.38 | 56,104.38 57.3,104.38 57.7,104.38 | 57.7,104.38 57.99,104.08 U2.78 | U2.82 56,104.38 | U2.84 55,104.38 | U2.88 53,104.38 | U2.3 44.24,100.62 | U2.43 v55.5,89.38 | U2.18 46.38,93.12 v46.62,93.38 | U2.67 59.5,97.62 v59.38,97.5 | 44.24,100.62 44.02,100.84 C16.1 43.6,103.4 v43,104 | 57.7,104.38 57.92,104.6 C15.1 60.75,104.62 v60.75,105.88 | U2.38 53,89 52.98,89 52.8,89.18 50.62,89.18 | 50.62,89.18 48.7,89.18 48.49,88.97 48.49,88.62 48.5,88.62 U2.29 | U1.193 U1.191 | U1.191 U1.189 | U1.192 U1.194 | C20.A C19.A | C19.A 24.75,68.1 C18.A | C19.A 27.25,66.25 XB1.1 | 53,104.38 49.5,104.38 | 48.5,104.38 49.5,104.38 | U2.99 47.5,104.12 47.76,104.38 48.5,104.38 | U2.6 44.5,99.12 44.38,99.25 | 44.24,100.62 44.24,99.38 44.38,99.25 | 44.38,99.25 44.38,98.62 U2.7 v46.61,98.62 v46.62,98.63 | U2.97 48.5,104.38 | U2.95 49.5,104.38 | v50.62,89.75 50.62,89.18 | v59.38,92.5 59.38,92.62 U2.57 60.6,92.63 61.74,92.63 61.98,92.4 C17.1 61.98,86.75 v62,86.75 | U1.191 76.42,69.95 76.12,70.25 U1.192 | TP_3V3.P$1 v28.75,83.25 | C1.+ v19.12,74.88 | J1.4 81.89,99.25 81,99.25 v80.88,99.12 | R7.1 8.35,11.88 5.5,11.88
  Top 0.305: C21.1 v71.12,23.25 72.15,23.25 | R20.2 9.97,24.88 v10,24.88
  Bottom 0.305: v34.38,89.5 34.82,89.5 34.83,89.51 U3.4
  pour Route2: 0,0 83,0 83,117.38 0,117.38
VCC_5V0  (via drill 0.25)
  Top 0.305: U6.1 18.3,84.83 v18.35,84.88 C4.+ | U6.7 21.7,77.8 v21.65,77.75 C3.+ | R2.2 R1.2 | R2.2 5.95,89.85 C14.1 4.33,88.15 U7.1 6.3,86.45 7.38,85.38 7.38,83.3 U12.5 10.1,82.08 13.93,82.08 v14.15,82.3 | R2.2 5.5,90.72 VR1.3 5.5,110.42 J3.2 8.59,113.5 15.75,113.5 U4.8 16.22,111.78 17.65,110.35 C7.1 23.5,109.47 28.77,109.47 v30.4,107.85 L3.1 29.98,105.08 U5.5 | U1.197 U1.199 80.33,72.38 76.5,72.38 76.22,72.65 74.88,72.65 | 74.88,72.65 U1.200 U1.198 71.05,72.05 70.38,71.38 70.38,70.65 C13.1 67.22,67.5 66.12,67.5 65.38,66.75 65.38,62.5 66.5,61.38 67.5,61.38 68.72,60.15 C8.1 68.72,58.2 U8.4 69.15,58.1 70.38,56.88 70.38,55.38 69.86,54.86 69.86,52.38 R21.2 R22.2 | R19.2 10,41.75 v10.12,41.62 | TP_5V0.P$1 27.48,83.6 v26.38,83.6 | v14.38,56.75 13.25,55.62 USB_A.VBUS | v74.88,83.5 74.88,82.62 | 74.88,82.62 74.88,72.65 | U11.5 74.8,82.55 74.88,82.62
  Route2 0.305: v30.4,107.85 61.77,107.85 74.88,94.75 v74.88,83.5
  Route15 0.305: v21.65,77.75 26.38,82.47 v26.38,83.6 | v10.12,41.62 11.62,41.62 13.25,43.25 13.25,55.62 v14.38,56.75 20.5,62.88 20.5,76.6 v21.65,77.75 | v18.35,84.88 15.85,84.88 14.15,83.17 v14.15,82.3 15.65,80.8 16.23,80.8 19.27,77.75 v21.65,77.75
VSYNC  (via drill 0.25)
  Top 0.127: v56.5,86 56.76,86.25 57.21,86.25 57.5,86.55 U2.47
  Bottom 0.127: v56.5,86 56.52,85.99 56.52,85.23 46.41,75.12 36.75,75.12 36.62,75 U3.33
XBEE_ASSOC
  Top 0.127: XB1.15 20.03,47.75 19.12,48.65 18.62,48.65 17.9,48.65 15.75,46.5 15.75,43.09 10.4,37.75 R16.2
XBEE_ON
  Top 0.127: XB1.13 37.12,47.38 19.65,47.38 19.12,46.85 17.8,46.85 16.46,45.5 16.46,42.86 10.83,37.24 10.83,31.48 R18.2
XBEE_RSSI
  Top 0.127: R17.2 10.5,35.27 10.5,37.38 16.12,43 16.12,45.75 18.12,47.75 XB1.6
XBEE_SLEEP_RQ  (via drill 0.25)
  Top 0.127: v78.75,35.88 79.12,35.88 79.25,35.75 U1.77 | XB1.9 33.5,41.75 v33.88,41.38
  Bottom 0.127: v78.75,35.88 39.12,35.88 34.25,40.75 34.25,41 v33.88,41.38

### Text on the board
tPlace: K | A | GND | 5V0 | 3V3 | 1V8 | USB uB | USB A | Normal / Boot | USB / Boot
tNames: Airball Display v1 | 2018-07-12 | HDMI TFT Interface | Dimmer / Knob | TFT / Dimming | Power Supply | Status | Raspberry Pi / Compute Module 3 | Power | Assoc. | RSSI | Radio On | SD Active | RTC | Config / Knob | RTC Battery / 3V CR12xx / Insert "+" up! | Designed by Jeremy Cole / for Airball.aero | Reno, Nevada / USA